# EAGLE design NSL_Tracker-1.2 (EAGLE 5.11)

## Sheet 1 of 7
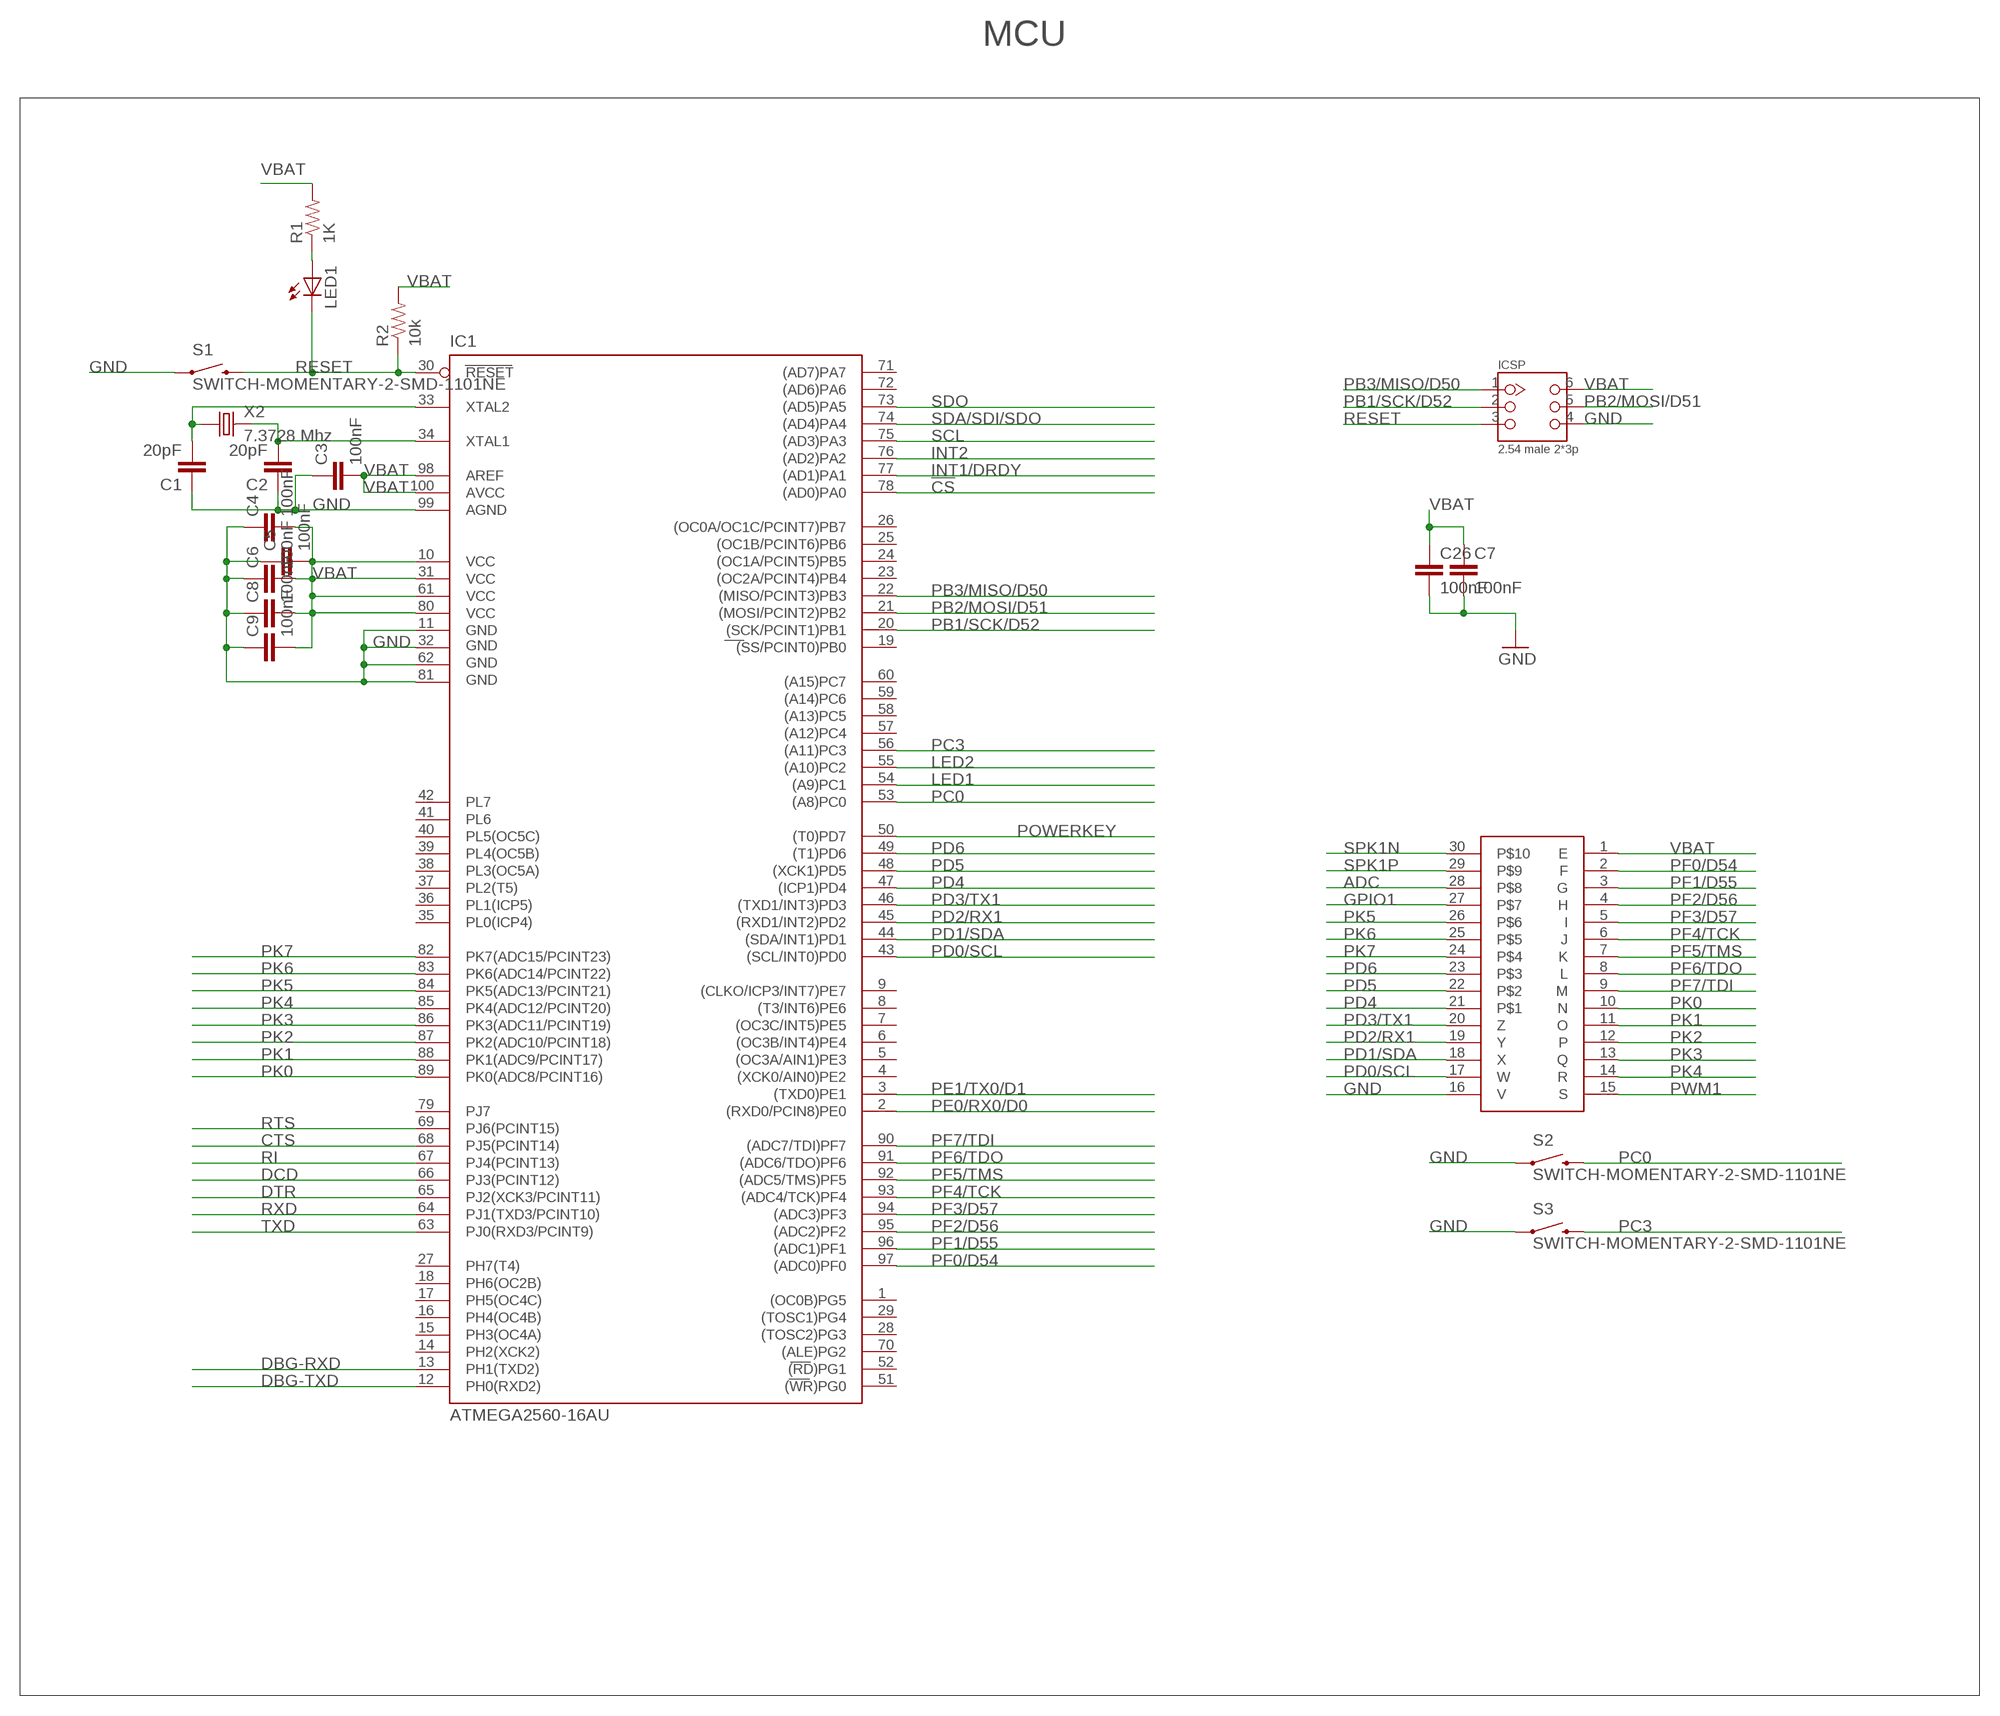
[diagram p0: schematic, sheet 1]

### Parts
C1  20pF  CAP0805  [0805]
C2  20pF  CAP0805  [0805]
C3  100nF  CAP0805  [0805]
C4  100nF  CAP0805  [0805]
C5  100nF  CAP0805  [0805]
C6  100nF  CAP0805  [0805]
C7  100nF  CAP0805  [0805]
C8  100nF  CAP0805  [0805]
C9  100nF  CAP0805  [0805]
C26  100nF  CAP0805  [0805]
IC1  ATMEGA2560-16AU  ATMEGA1280-16AU  [TQFP100]
ICSP  2.54 male 2*3p  HEADER-2X3P2.54  [CK_2X3]
LED1  LEDCHIP-LED0603  [CHIP-LED0603]
R1  1K  RESISTOR0805-RES  [0805]
R2  10k  RESISTOR0805-RES  [0805]
S1  SWITCH-MOMENTARY-2-SMD-1101NE  [TACTILE-SWITCH-1101NE]
S2  SWITCH-MOMENTARY-2-SMD-1101NE  [TACTILE-SWITCH-1101NE]
S3  SWITCH-MOMENTARY-2-SMD-1101NE  [TACTILE-SWITCH-1101NE]
U$1  M30  [M50-2X15]
X2  7.3728 Mhz  CRYSTAL-HC49UP  [HC49UP]

### Nets
!CS: IC1.78((AD0)PA0) ; also sheet 7
ADC: U$1.28 ; also sheet 2
CTS: IC1.68(PJ5(PCINT14)) ; also sheet 2
DBG-RXD: IC1.13(PH1(TXD2)) ; also sheet 2
DBG-TXD: IC1.12(PH0(RXD2)) ; also sheet 2
DCD: IC1.66(PJ3(PCINT12)) ; also sheet 2
DTR: IC1.65(PJ2(XCK3/PCINT11)) ; also sheet 2
GND: C1.1 C2.1 C3.1 C4.1 C5.1 C6.1 C7.2 C8.1 C9.1 C26.2 IC1.11(GND) IC1.32(GND1) IC1.62(GND2) IC1.81(GND3) IC1.99(AGND) ICSP.4 S1.P$1 S2.P$1 S3.P$1 U$1.16(V) ; also sheet 2,3,4,5,6,7
GPIO1: U$1.27 ; also sheet 2
INT1/DRDY: IC1.77((AD1)PA1) ; also sheet 7
INT2: IC1.76((AD2)PA2) ; also sheet 7
LED1: IC1.54((A9)PC1) ; also sheet 4
LED2: IC1.55((A10)PC2) ; also sheet 4
N$2: C2.2 IC1.34(XTAL1) X2.2
N$3: C1.2 IC1.33(XTAL2) X2.1
N$38: LED1.A R1.1
PB1/SCK/D52: IC1.20((SCK/PCINT1)PB1) ICSP.2
PB2/MOSI/D51: IC1.21((MOSI/PCINT2)PB2) ICSP.5
PB3/MISO/D50: IC1.22((MISO/PCINT3)PB3) ICSP.1
PC0: IC1.53((A8)PC0) S2.P$2
PC3: IC1.56((A11)PC3) S3.P$2
PD0/SCL: IC1.43((SCL/INT0)PD0) U$1.17(W)
PD1/SDA: IC1.44((SDA/INT1)PD1) U$1.18(X)
PD2/RX1: IC1.45((RXD1/INT2)PD2) U$1.19(Y)
PD3/TX1: IC1.46((TXD1/INT3)PD3) U$1.20(Z)
PD4: IC1.47((ICP1)PD4) U$1.21
PD5: IC1.48((XCK1)PD5) U$1.22
PD6: IC1.49((T1)PD6) U$1.23
PE0/RX0/D0: IC1.2((RXD0/PCIN8)PE0) ; also sheet 3
PE1/TX0/D1: IC1.3((TXD0)PE1) ; also sheet 3
PF0/D54: IC1.97((ADC0)PF0) U$1.2(F)
PF1/D55: IC1.96((ADC1)PF1) U$1.3(G)
PF2/D56: IC1.95((ADC2)PF2) U$1.4(H)
PF3/D57: IC1.94((ADC3)PF3) U$1.5(I)
PF4/TCK: IC1.93((ADC4/TCK)PF4) U$1.6(J)
PF5/TMS: IC1.92((ADC5/TMS)PF5) U$1.7(K)
PF6/TDO: IC1.91((ADC6/TDO)PF6) U$1.8(L)
PF7/TDI: IC1.90((ADC7/TDI)PF7) U$1.9(M)
PK0: IC1.89(PK0(ADC8/PCINT16)) U$1.10(N)
PK1: IC1.88(PK1(ADC9/PCINT17)) U$1.11(O)
PK2: IC1.87(PK2(ADC10/PCINT18)) U$1.12(P)
PK3: IC1.86(PK3(ADC11/PCINT19)) U$1.13(Q)
PK4: IC1.85(PK4(ADC12/PCINT20)) U$1.14(R)
PK5: IC1.84(PK5(ADC13/PCINT21)) U$1.26
PK6: IC1.83(PK6(ADC14/PCINT22)) U$1.25
PK7: IC1.82(PK7(ADC15/PCINT23)) U$1.24
POWERKEY: IC1.50((T0)PD7) ; also sheet 4
PWM1: U$1.15(S) ; also sheet 2
RESET: IC1.30(RESET) ICSP.3 LED1.C R2.1 S1.P$2
RI: IC1.67(PJ4(PCINT13)) ; also sheet 2
RTS: IC1.69(PJ6(PCINT15)) ; also sheet 2
RXD: IC1.64(PJ1(TXD3/PCINT10)) ; also sheet 2
SCL: IC1.75((AD3)PA3) ; also sheet 7
SDA/SDI/SDO: IC1.74((AD4)PA4) ; also sheet 7
SDO: IC1.73((AD5)PA5) ; also sheet 7
SPK1N: U$1.30 ; also sheet 2
SPK1P: U$1.29 ; also sheet 2
TXD: IC1.63(PJ0(RXD3/PCINT9)) ; also sheet 2
VBAT: C3.2 C4.2 C5.2 C6.2 C7.1 C8.2 C9.2 C26.1 IC1.10(VCC) IC1.31(VCC1) IC1.61(VCC2) IC1.80(VCC3) IC1.98(AREF) IC1.100(AVCC) ICSP.6 R1.2 R2.2 U$1.1(E) ; also sheet 2,3,4,5,7
Unconnected: IC1.1((OC0B)PG5) IC1.4((XCK0/AIN0)PE2) IC1.5((OC3A/AIN1)PE3) IC1.6((OC3B/INT4)PE4) IC1.7((OC3C/INT5)PE5) IC1.8((T3/INT6)PE6) IC1.9((CLKO/ICP3/INT7)PE7) IC1.14(PH2(XCK2)) IC1.15(PH3(OC4A)) IC1.16(PH4(OC4B)) IC1.17(PH5(OC4C)) IC1.18(PH6(OC2B)) IC1.19((SS/PCINT0)PB0) IC1.23((OC2A/PCINT4)PB4) IC1.24((OC1A/PCINT5)PB5) IC1.25((OC1B/PCINT6)PB6) IC1.26((OC0A/OC1C/PCINT7)PB7) IC1.27(PH7(T4)) IC1.28((TOSC2)PG3) IC1.29((TOSC1)PG4) IC1.35(PL0(ICP4)) IC1.36(PL1(ICP5)) IC1.37(PL2(T5)) IC1.38(PL3(OC5A)) IC1.39(PL4(OC5B)) IC1.40(PL5(OC5C)) IC1.41(PL6) IC1.42(PL7) IC1.51((WR)PG0) IC1.52((RD)PG1) IC1.57((A12)PC4) IC1.58((A13)PC5) IC1.59((A14)PC6) IC1.60((A15)PC7) IC1.70((ALE)PG2) IC1.71((AD7)PA7) IC1.72((AD6)PA6) IC1.79(PJ7)

### Notes on the sheet
- MCU

## Sheet 2 of 7
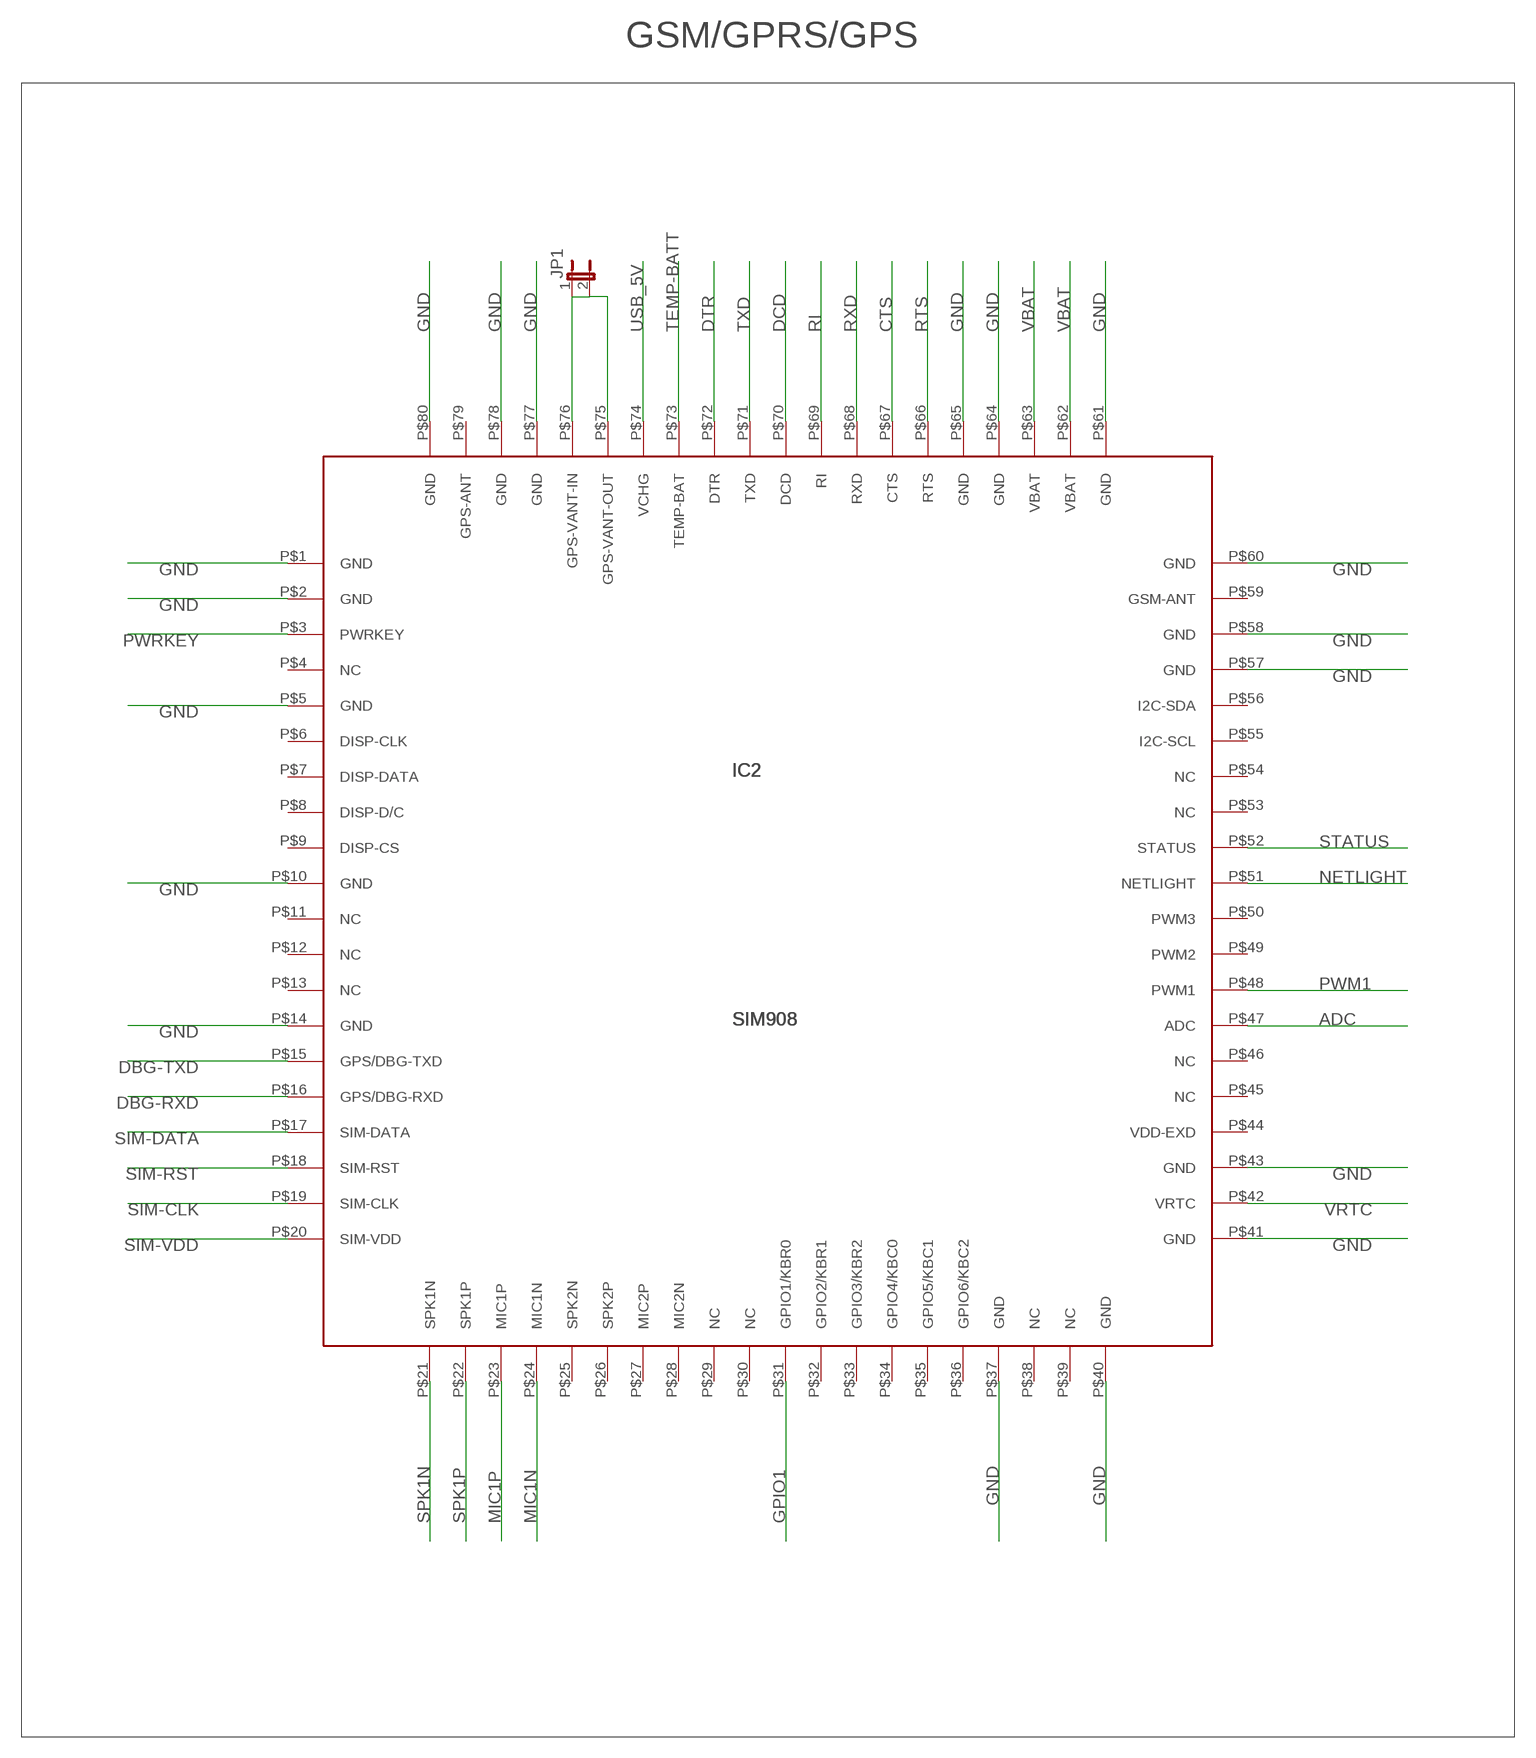
[diagram p1: schematic, sheet 2]

### Parts
IC2  SIM908  [SIM908]
JP1  JUMPER-2SMD-NC  [SJ_2S]

### Nets
ADC: IC2.P$47(ADC) ; also sheet 1
CTS: IC2.P$67(CTS) ; also sheet 1
DBG-RXD: IC2.P$16(GPS/DBG-RXD) ; also sheet 1
DBG-TXD: IC2.P$15(GPS/DBG-TXD) ; also sheet 1
DCD: IC2.P$70(DCD) ; also sheet 1
DTR: IC2.P$72(DTR) ; also sheet 1
GND: IC2.P$1(GND) IC2.P$2(GND) IC2.P$5(GND) IC2.P$10(GND) IC2.P$14(GND) IC2.P$37(GND) IC2.P$40(GND) IC2.P$41(GND) IC2.P$43(GND) IC2.P$57(GND) IC2.P$58(GND) IC2.P$60(GND) IC2.P$61(GND) IC2.P$64(GND) IC2.P$65(GND) IC2.P$77(GND) IC2.P$78(GND) IC2.P$80(GND) ; also sheet 1,3,4,5,6,7
GPIO1: IC2.P$31(GPIO1/KBR0) ; also sheet 1
MIC1N: IC2.P$24(MIC1N) ; also sheet 6
MIC1P: IC2.P$23(MIC1P) ; also sheet 6
N$4: IC2.P$75(GPS-VANT-OUT) IC2.P$76(GPS-VANT-IN) JP1.1 JP1.2
NETLIGHT: IC2.P$51(NETLIGHT) ; also sheet 4
PWM1: IC2.P$48(PWM1) ; also sheet 1
PWRKEY: IC2.P$3(PWRKEY) ; also sheet 4
RI: IC2.P$69(RI) ; also sheet 1
RTS: IC2.P$66(RTS) ; also sheet 1
RXD: IC2.P$68(RXD) ; also sheet 1
SIM-CLK: IC2.P$19(SIM-CLK) ; also sheet 4
SIM-DATA: IC2.P$17(SIM-DATA) ; also sheet 4
SIM-RST: IC2.P$18(SIM-RST) ; also sheet 4
SIM-VDD: IC2.P$20(SIM-VDD) ; also sheet 4
SPK1N: IC2.P$21(SPK1N) ; also sheet 1
SPK1P: IC2.P$22(SPK1P) ; also sheet 1
STATUS: IC2.P$52(STATUS) ; also sheet 4
TEMP-BATT: IC2.P$73(TEMP-BAT) ; also sheet 5
TXD: IC2.P$71(TXD) ; also sheet 1
USB_5V: IC2.P$74(VCHG) ; also sheet 3,5
VBAT: IC2.P$62(VBAT) IC2.P$63(VBAT) ; also sheet 1,3,4,5,7
VRTC: IC2.P$42(VRTC) ; also sheet 5
Unconnected: IC2.P$4(NC) IC2.P$6(DISP-CLK) IC2.P$7(DISP-DATA) IC2.P$8(DISP-D/C) IC2.P$9(DISP-CS) IC2.P$11(NC) IC2.P$12(NC) IC2.P$13(NC) IC2.P$25(SPK2N) IC2.P$26(SPK2P) IC2.P$27(MIC2P) IC2.P$28(MIC2N) IC2.P$29(NC) IC2.P$30(NC) IC2.P$32(GPIO2/KBR1) IC2.P$33(GPIO3/KBR2) IC2.P$34(GPIO4/KBC0) IC2.P$35(GPIO5/KBC1) IC2.P$36(GPIO6/KBC2) IC2.P$38(NC) IC2.P$39(NC) IC2.P$44(VDD-EXD) IC2.P$45(NC) IC2.P$46(NC) IC2.P$49(PWM2) IC2.P$50(PWM3) IC2.P$53(NC) IC2.P$54(NC) IC2.P$55(I2C-SCL) IC2.P$56(I2C-SDA) IC2.P$59(GSM-ANT) IC2.P$79(GPS-ANT)

### Notes on the sheet
- GSM/GPRS/GPS

## Sheet 3 of 7
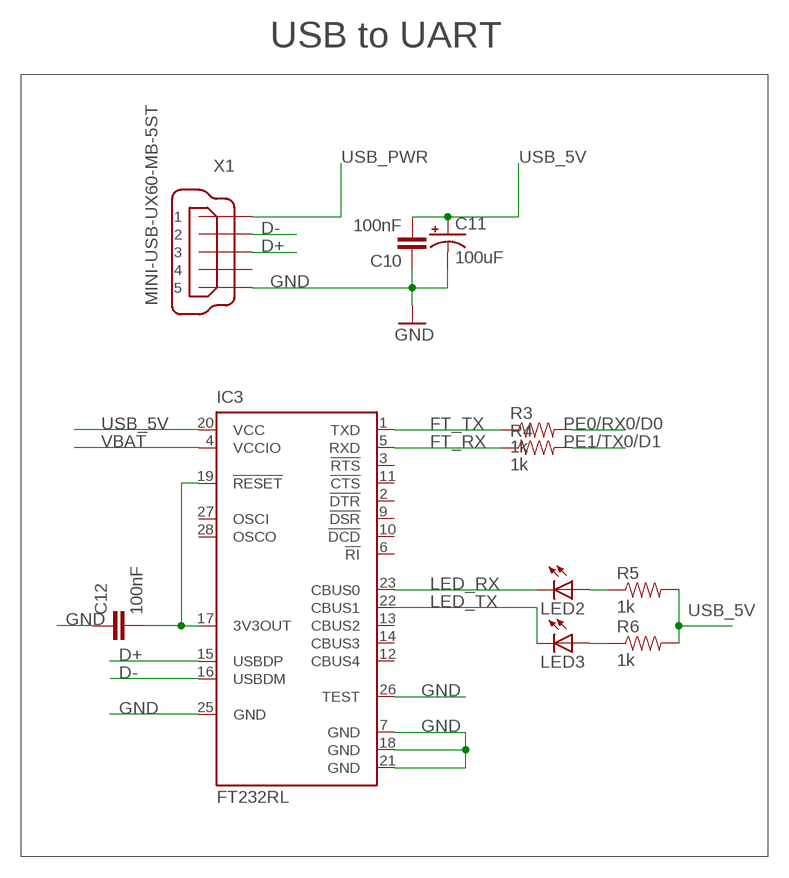
[diagram p2: schematic, sheet 3]

### Parts
C10  100nF  CAP0805  [0805]
C11  100uF  CAP_POL7343  [EIA7343]
C12  100nF  CAP0805  [0805]
IC3  FT232RL  [SSOP28]
LED2  LEDCHIP-LED0603  [CHIP-LED0603]
LED3  LEDCHIP-LED0603  [CHIP-LED0603]
R3  1k  RESISTOR0805-RES  [0805]
R4  1k  RESISTOR0805-RES  [0805]
R5  1k  RESISTOR0805-RES  [0805]
R6  1k  RESISTOR0805-RES  [0805]
X1  MINI-USB-UX60-MB-5ST  [UX60-MB-5ST]

### Nets
D+: IC3.15(USBDP) X1.3
D-: IC3.16(USBDM) X1.2
FT_RX: IC3.5(RXD) R4.1
FT_TX: IC3.1(TXD) R3.1
GND: C10.1 C11.C(-) C12.1 IC3.7(GND) IC3.18(GND) IC3.21(GND) IC3.25(GND) IC3.26(TEST) X1.5 ; also sheet 1,2,4,5,6,7
LED_RX: IC3.23(CBUS0) LED2.C
LED_TX: IC3.22(CBUS1) LED3.C
N$1: C12.2 IC3.17(3V3OUT) IC3.19(!RESET)
N$18: LED2.A R5.1
N$19: LED3.A R6.1
PE0/RX0/D0: R3.2 ; also sheet 1
PE1/TX0/D1: R4.2 ; also sheet 1
USB_5V: C10.2 C11.A(+) IC3.20(VCC) R5.2 R6.2 ; also sheet 2,5
USB_PWR: X1.1 ; also sheet 5
VBAT: IC3.4(VCCIO) ; also sheet 1,2,4,5,7
Unconnected: IC3.2(!DTR) IC3.3(!RTS) IC3.6(!RI) IC3.9(!DSR) IC3.10(!DCD) IC3.11(!CTS) IC3.12(CBUS4) IC3.13(CBUS2) IC3.14(CBUS3) IC3.27(OSCI) IC3.28(OSCO) X1.4

### Notes on the sheet
- USB to UART

## Sheet 4 of 7
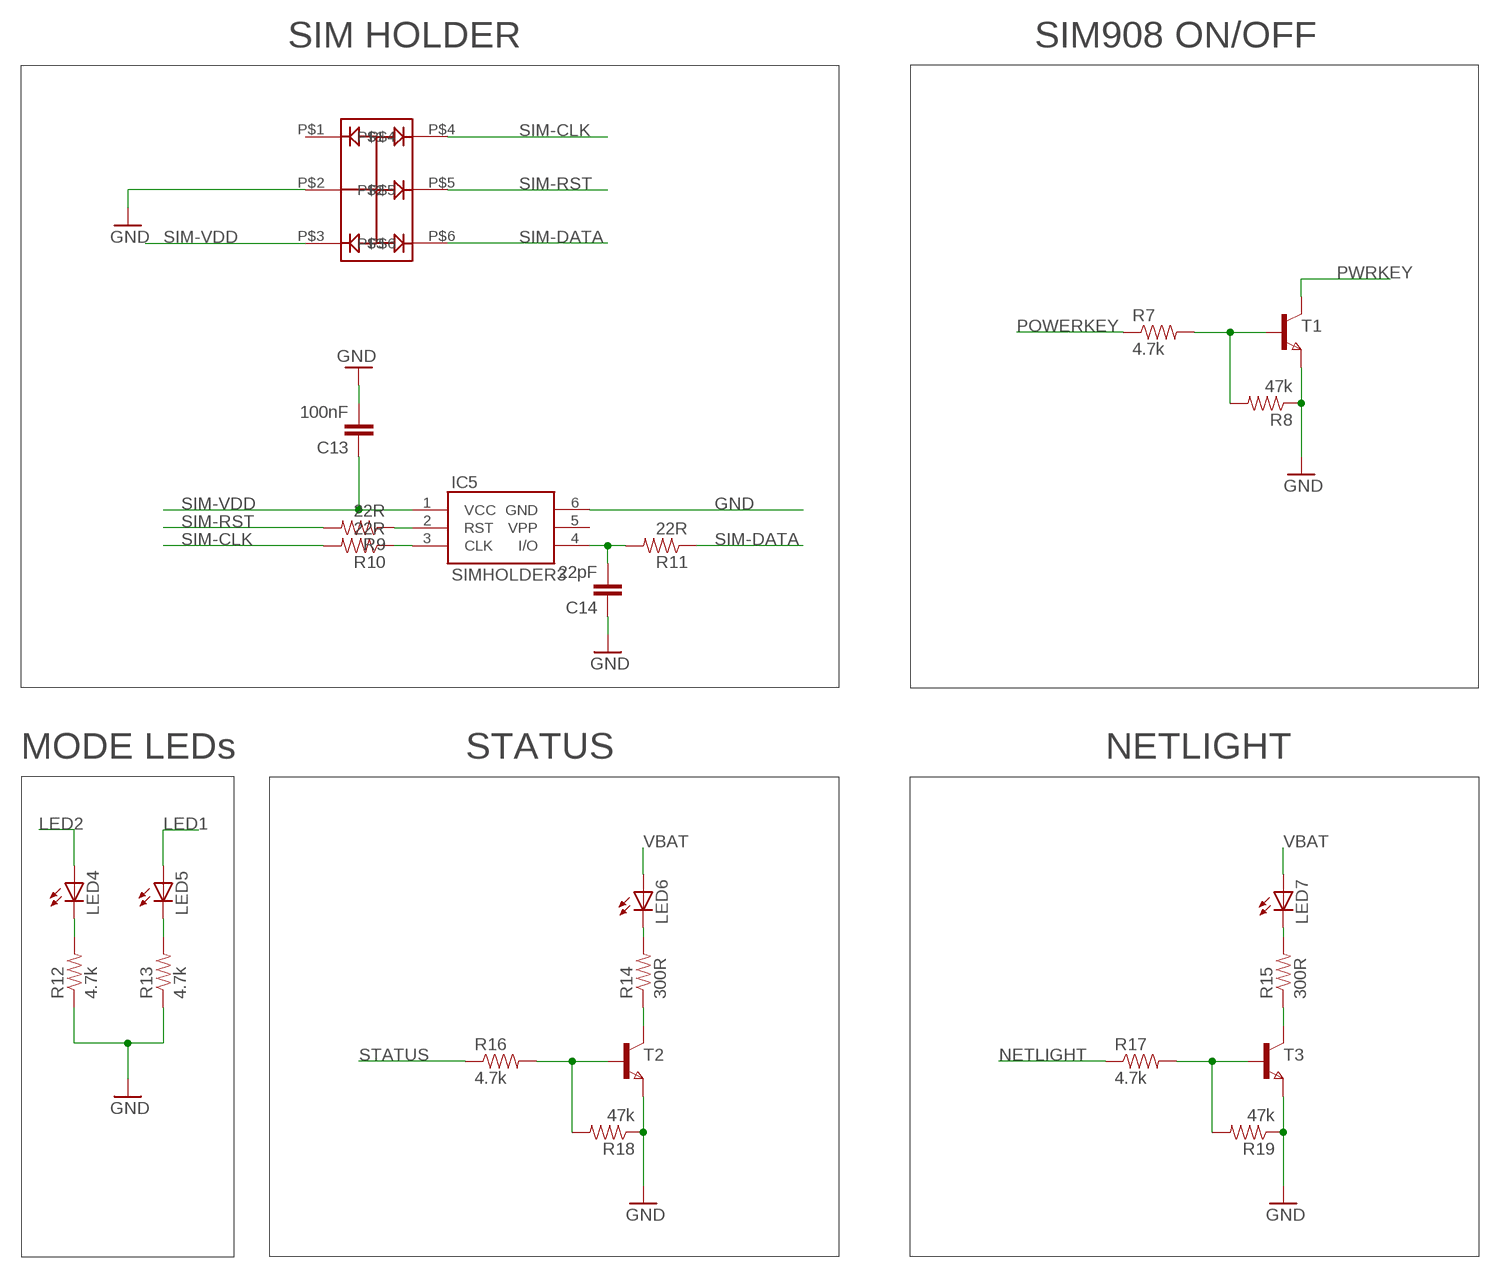
[diagram p3: schematic, sheet 4]

### Parts
C13  100nF  CAP0805  [0805]
C14  22pF  CAP0805  [0805]
IC4  SMF05C  [SC-88]
IC5  SIMHOLDER3  [SIMHOLDER3]
LED4  LEDCHIP-LED0603  [CHIP-LED0603]
LED5  LEDCHIP-LED0603  [CHIP-LED0603]
LED6  LEDCHIP-LED0603  [CHIP-LED0603]
LED7  LEDCHIP-LED0603  [CHIP-LED0603]
R7  4.7k  RESISTOR0805-RES  [0805]
R8  47k  RESISTOR0805-RES  [0805]
R9  22R  RESISTOR0805-RES  [0805]
R10  22R  RESISTOR0805-RES  [0805]
R11  22R  RESISTOR0805-RES  [0805]
R12  4.7k  RESISTOR0805-RES  [0805]
R13  4.7k  RESISTOR0805-RES  [0805]
R14  300R  RESISTOR0805-RES  [0805]
R15  300R  RESISTOR0805-RES  [0805]
R16  4.7k  RESISTOR0805-RES  [0805]
R17  4.7k  RESISTOR0805-RES  [0805]
R18  47k  RESISTOR0805-RES  [0805]
R19  47k  RESISTOR0805-RES  [0805]
T1  NPNSOT23  [SOT-23]
T2  NPNSOT23  [SOT-23]
T3  NPNSOT23  [SOT-23]

### Nets
GND: C13.2 C14.1 IC4.P$2 IC5.6(GND) R8.1 R12.1 R13.1 R18.1 R19.1 T1.2(E) T2.2(E) T3.2(E) ; also sheet 1,2,3,5,6,7
LED1: LED5.A ; also sheet 1
LED2: LED4.A ; also sheet 1
N$6: R17.2 R19.2 T3.3(B)
N$7: R7.2 R8.2 T1.3(B)
N$8: IC5.2(RST) R9.1
N$9: IC5.3(CLK) R10.1
N$10: C14.2 IC5.4(I/O) R11.2
N$11: LED7.C R15.2
N$12: R15.1 T3.1(C)
N$13: R16.2 R18.2 T2.3(B)
N$14: LED6.C R14.2
N$15: R14.1 T2.1(C)
N$20: LED5.C R13.2
N$21: LED4.C R12.2
NETLIGHT: R17.1 ; also sheet 2
POWERKEY: R7.1 ; also sheet 1
PWRKEY: T1.1(C) ; also sheet 2
SIM-CLK: IC4.P$4 R10.2 ; also sheet 2
SIM-DATA: IC4.P$6 R11.1 ; also sheet 2
SIM-RST: IC4.P$5 R9.2 ; also sheet 2
SIM-VDD: C13.1 IC4.P$3 IC5.1(VCC) ; also sheet 2
STATUS: R16.1 ; also sheet 2
VBAT: LED6.A LED7.A ; also sheet 1,2,3,5,7
Unconnected: IC4.P$1 IC5.5(VPP)

### Notes on the sheet
- SIM HOLDER | SIM908 ON/OFF
- MODE LEDs | STATUS | NETLIGHT

## Sheet 5 of 7
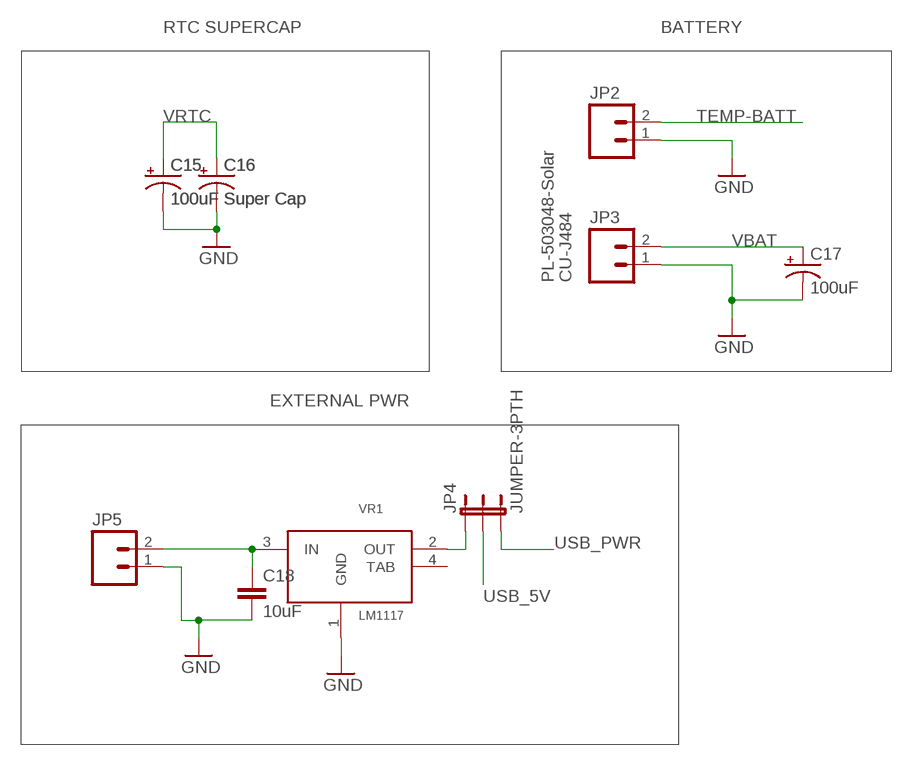
[diagram p4: schematic, sheet 5]

### Parts
C15  100uF  CAP_POL7343  [EIA7343]
C16  Super Cap  CAP_POL322510  [322510_SUPERCAP]
C17  100uF  CAP_POL7343  [EIA7343]
C18  10uF  CAP0805  [0805]
JP2  M02PTH  [1X02]
JP3  M02POLAR  [MOLEX-1X2]
JP4  JUMPER-3PTH  [1X03]
JP5  M02POLAR  [MOLEX-1X2]
VR1  LM1117  [SOT-223]

### Nets
GND: C15.C(-) C16.2(-) C17.C(-) C18.2 JP2.1 JP3.1 JP5.1 VR1.1(GND) ; also sheet 1,2,3,4,6,7
N$16: C18.1 JP5.2 VR1.3(IN)
N$17: JP4.1 VR1.2(OUT)
TEMP-BATT: JP2.2 ; also sheet 2
USB_5V: JP4.2 ; also sheet 2,3
USB_PWR: JP4.3 ; also sheet 3
VBAT: C17.A(+) JP3.2 ; also sheet 1,2,3,4,7
VRTC: C15.A(+) C16.1(+) ; also sheet 2
Unconnected: VR1.4(TAB)

### Notes on the sheet
- RTC SUPERCAP | BATTERY
- PL-503048-Solar | CU-J484
- EXTERNAL PWR

## Sheet 6 of 7
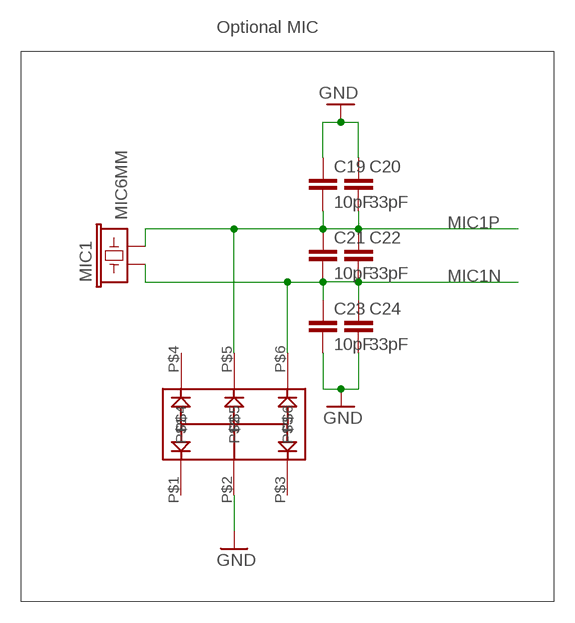
[diagram p5: schematic, sheet 6]

### Parts
C19  10pF  CAP0805  [0805]
C20  33pF  CAP0805  [0805]
C21  10pF  CAP0805  [0805]
C22  33pF  CAP0805  [0805]
C23  10pF  CAP0805  [0805]
C24  33pF  CAP0805  [0805]
IC6  SMF05C  [SC-88]
MIC1  MIC6MM  [MIC-6MM]

### Nets
GND: C19.1 C20.1 C23.2 C24.2 IC6.P$2 ; also sheet 1,2,3,4,5,7
MIC1N: C21.2 C22.2 C23.1 C24.1 IC6.P$6 MIC1.1 ; also sheet 2
MIC1P: C19.2 C20.2 C21.1 C22.1 IC6.P$5 MIC1.2 ; also sheet 2
Unconnected: IC6.P$1 IC6.P$3 IC6.P$4

### Notes on the sheet
- Optional MIC

## Sheet 7 of 7
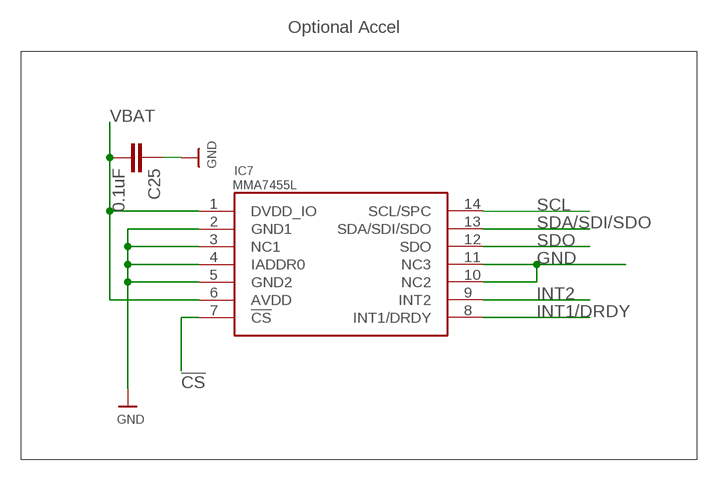
[diagram p6: schematic, sheet 7]

### Parts
C25  0.1uF  CAP0805  [0805]
IC7  MMA7455L  [LGA-14]

### Nets
!CS: IC7.7(!CS) ; also sheet 1
GND: C25.1 IC7.2(GND1) IC7.3(NC1) IC7.4(IADDR0) IC7.5(GND2) IC7.10(NC2) IC7.11(NC3) ; also sheet 1,2,3,4,5,6
INT1/DRDY: IC7.8(INT1/DRDY) ; also sheet 1
INT2: IC7.9(INT2) ; also sheet 1
SCL: IC7.14(SCL/SPC) ; also sheet 1
SDA/SDI/SDO: IC7.13(SDA/SDI/SDO) ; also sheet 1
SDO: IC7.12(SDO) ; also sheet 1
VBAT: C25.2 IC7.1(DVDD_IO) IC7.6(AVDD) ; also sheet 1,2,3,4,5

### Notes on the sheet
- Optional Accel

## Library data of the parts
C1-C10 C12-C14 C18-C26 = SparkFun:CAP: Capacitor Standard 0603 ceramic capacitor, and 0.1" leaded capacitor.
C11 C17 = SparkFun:CAP_POL: Capacitor Polarized These are standard SMD and PTH capacitors. Normally 10uF, 47uF, and 100uF in electrolytic and tantalum varieties. Always verify the external diameter of the through hole cap, it varies with capacity, voltage, and manufacturer. The EIA devices should be standard.
C15 C16 = NSL_Tracker:CAP_POL: Capacitor Polarized These are standard SMD and PTH capacitors. Normally 10uF, 47uF, and 100uF in electrolytic and tantalum varieties. Always verify the external diameter of the through hole cap, it varies with capacity, voltage, and manufacturer. The EIA devices should be standard.
IC1 = ICs_v54:ATMEGA*: MICROCONTROLLER 64/128/256 Kbytes FLASH 4 Kbytes EEPROM 8 Kbytes SRAM 86 General Purpose I/O pins 12-channels16-bit PWM 4 x Serial USARTs 16-channels 10-bit A/D
IC2 = NSL_Tracker:SIM908
IC3 = ICs_v54:FT232R: Source: http://www.ftdichip.com/Documents/DataSheets/DS_FT232R_v104.pdf
IC4 IC6 = NSL_Tracker:SMF05C
IC5 = SparkFun:SIMHOLDER3
IC7 = MMA7455Lbreakoutboard-v1a:MMA7455L
ICSP = Connector:HEADER-2X3P
JP1 = SparkFun:JUMPER-2: Jumper Basic 0.1" spaced jumper. Use with breakaway headers.
JP2 = SparkFun:M02: Header 2 Standard 2-pin 0.1" header. Use with straight break away headers (SKU : PRT-00116), right angle break away headers (PRT-00553), swiss pins (PRT-00743), machine pins (PRT-00117), and female headers (PRT-00115). Molex polarized connector foot print use with SKU : PRT-08233 with associated crimp pins and housings.
JP3 JP5 = PWM_ATUC64L4U:M02: Header 2 Standard 2-pin 0.1" header. Use with straight break away headers (SKU : PRT-00116), right angle break away headers (PRT-00553), swiss pins (PRT-00743), machine pins (PRT-00117), and female headers (PRT-00115). Molex polarized connector foot print use with SKU : PRT-08233 with associated crimp pins and housings.
JP4 = SparkFun:JUMPER-3
LED1-LED7 = led:LED: LED OSRAM: - CHIPLED LG R971, LG N971, LY N971, LG Q971, LY Q971, LO R971, LY R971 LH N974, LH R974 LS Q976, LO Q976, LY Q976 LO Q996 - Hyper CHIPLED LW Q18S LB Q993, LB Q99A, LB R99A - SideLED LS A670, LO A670, LY A670, LG A670, LP A670 LB A673, LV A673, LT A673, LW A673 LH A674 LY A675 LS A676, LA A676, LO A676, LY A676, LW A676 LS A679, LY A679, LG A679 - Hyper Micro SIDELED® LS Y876, LA Y876, LO Y876, LY Y876 LT Y87S - SmartLED LW L88C, LW L88S LB L89C, LB L89S, LG L890 LS L89K, LO L89K, LY L89K LS L896, LA L896, LO L896, LY L896 - TOPLED LS T670, LO T670, LY T670, LG T670, LP T670 LSG T670, LSP T670, LSY T670, LOP T670, LYG T670 LG T671, LOG T671, LSG T671 LB T673, LV T673, LT T673, LW T673 LH T674 LS T676, LA T676, LO T676, LY T676, LB T676, LH T676, LSB T676, LW T676 LB T67C, LV T67C, LT T67C, LS T67K, LO T67K, LY T67K, LW E67C LS E67B, LA E67B, LO E67B, LY E67B, LB E67C, LV E67C, LT E67C LW T67C LS T679, LY T679, LG T679 LS T770, LO T770, LY T770, LG T770, LP T770 LB T773, LV T773, LT T773, LW T773 LH T774 LS E675, LA E675, LY E675, LS T675 LS T776, LA T776, LO T776, LY T776, LB T776 LHGB T686 LT T68C, LB T68C - Hyper Mini TOPLED® LB M676 - Mini TOPLED Santana® LG M470 LS M47K, LO M47K, LY M47K Source: http://www.osram.convergy.de LUXEON: - LUMILED® LXK2-PW12-R00, LXK2-PW12-S00, LXK2-PW14-U00, LXK2-PW14-V00 LXK2-PM12-R00, LXK2-PM12-S00, LXK2-PM14-U00 LXK2-PE12-Q00, LXK2-PE12-R00, LXK2-PE12-S00, LXK2-PE14-T00, LXK2-PE14-U00 LXK2-PB12-K00, LXK2-PB12-L00, LXK2-PB12-M00, LXK2-PB14-N00, LXK2-PB14-P00, LXK2-PB14-Q00 LXK2-PR12-L00, LXK2-PR12-M00, LXK2-PR14-Q00, LXK2-PR14-R00 LXK2-PD12-Q00, LXK2-PD12-R00, LXK2-PD12-S00 LXK2-PH12-R00, LXK2-PH12-S00 LXK2-PL12-P00, LXK2-PL12-Q00, LXK2-PL12-R00 Source: www.luxeon.com KINGBRIGHT: KA-3528ASYC Source: www.kingbright.com
MIC1 = slice_noshift:MIC: Microphone Omni-directional electret microphone. 9.7mm standard diameter.
R1-R19 = SparkFun:RESISTOR: Resistor Basic schematic elements and footprints for 0603, 1206, and PTH resistors.
S1-S3 = NSL_Tracker:SWITCH-MOMENTARY-2
T1-T3 = zetex:NPNSOT23: NPN TRANSISTOR; MPN: DSS20201L-7; OC_FARNELL: 1710688; OC_NEWARK: 25R4555
U$1 = NSL_Tracker:M30
VR1 = pcbqr_v4:LM1117
X1 = ATCUxxxl3U_Synth_4layer:MINI-USB-: MINI USB Connector Source: http://www.hirose.co.jp/cataloge_hp/e24000019.pdf; OC_FARNELL: unknown; OC_NEWARK: unknown
X2 = NSL_Tracker:CRYSTAL*: CRYSTAL

## Board
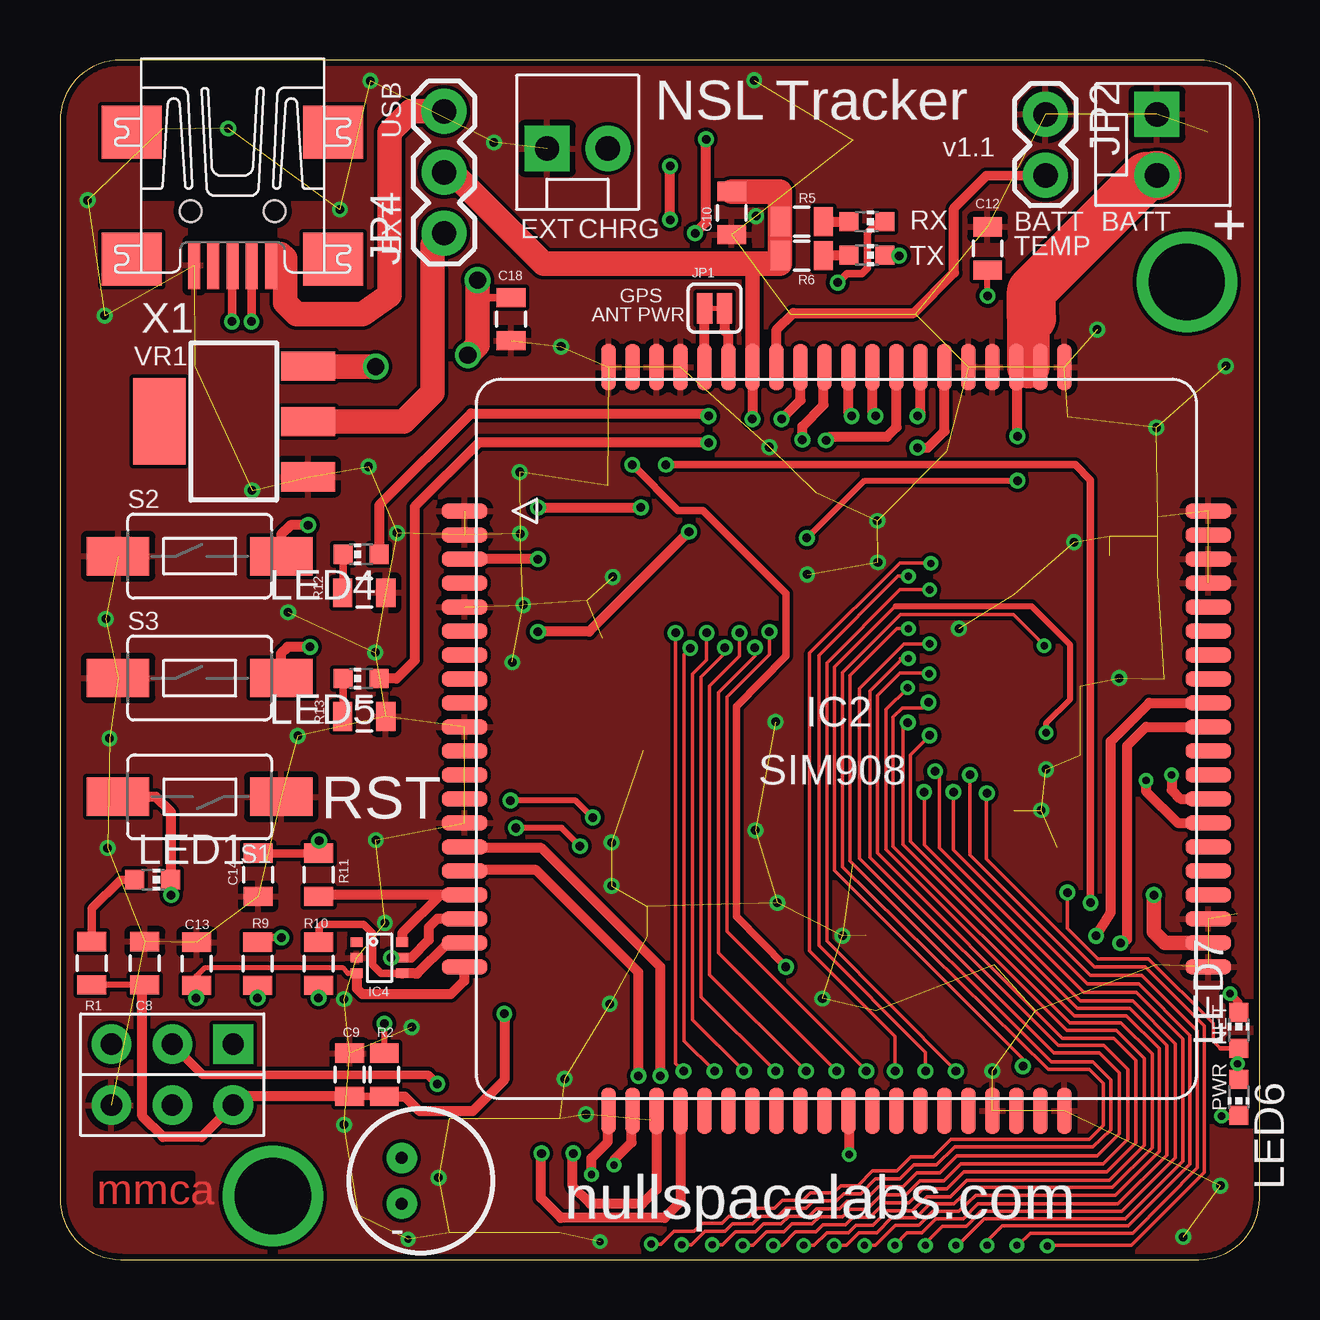
[diagram p7: board, top side]
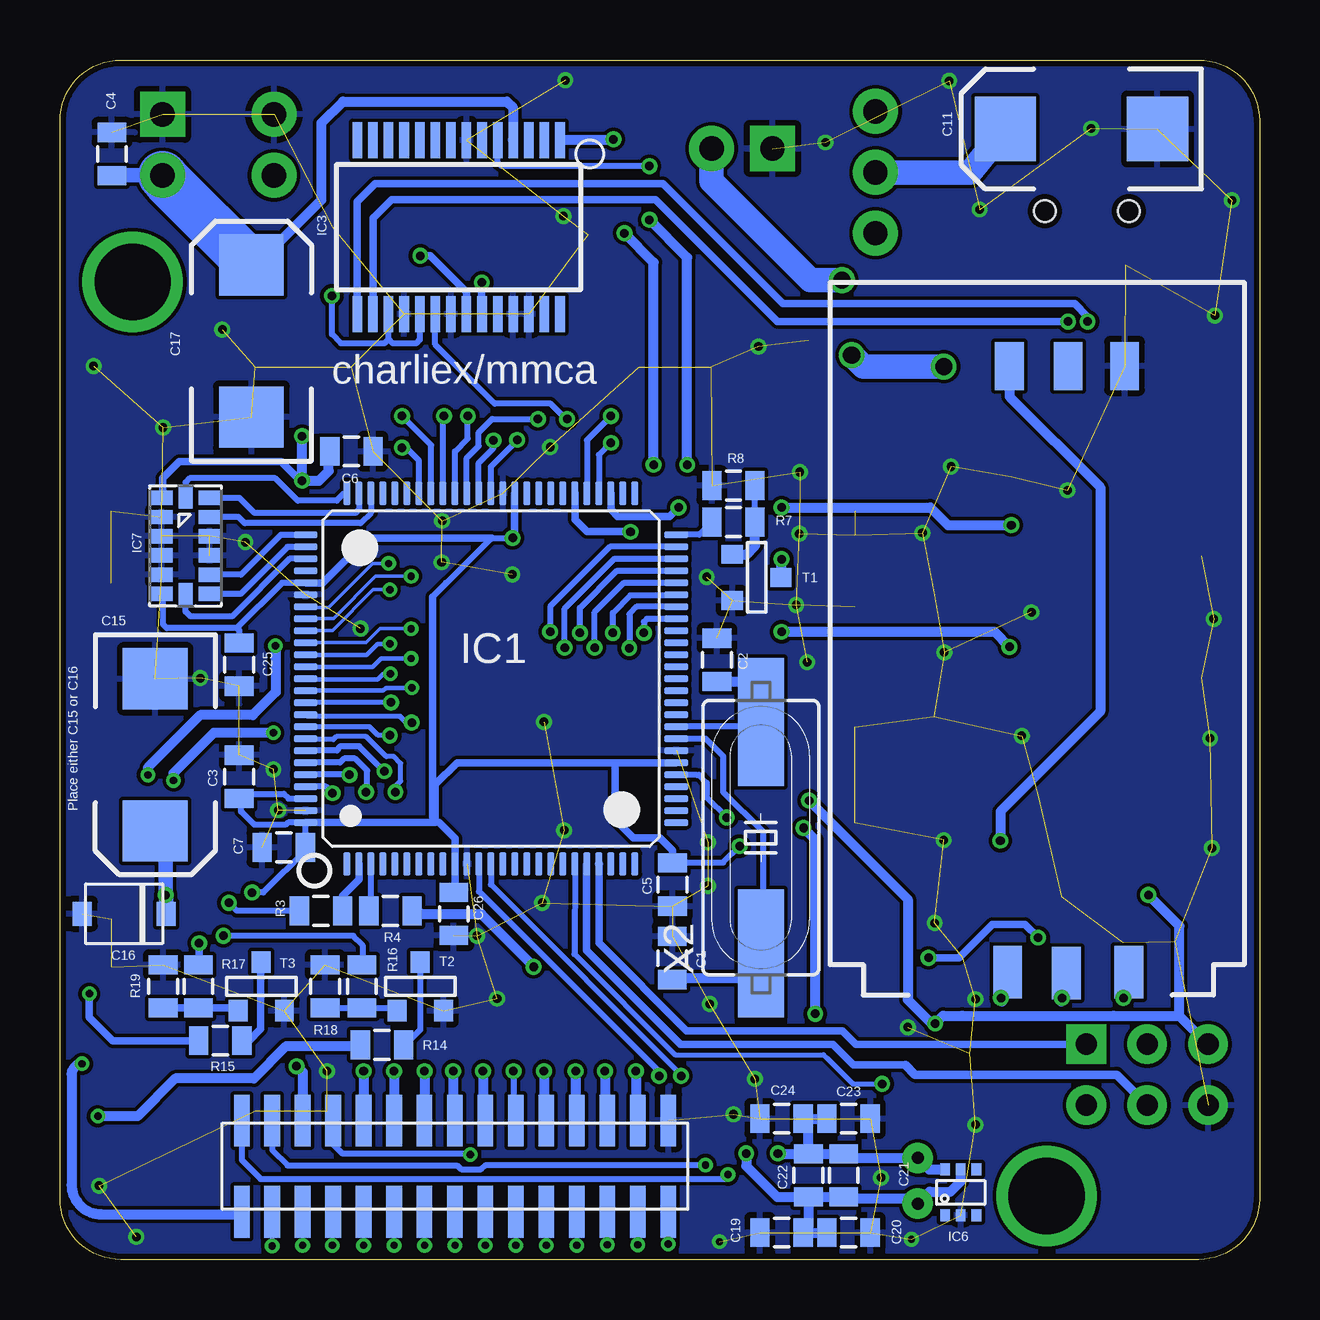
[diagram p8: board, bottom side, seen from below]

Size 50 x 50 mm. Coordinates in mm from the lower left corner, seen from the top.
Outline: 47.46,0 arc90 50,2.54 50,47.46 arc90 47.46,50 2.54,50 arc90 0,47.46 0,2.54 arc90 2.54,0 47.46,0
Copper layers (1*16): Top 0.035mm / dielectric 1.5mm / Bottom 0.035mm
Design rules "ITead_rule *": minimum track width 6mil, minimum drill 12mil, track to track 6mil, track to pad 6mil, pad to pad 6mil, via to via 6mil, smd to smd 0mil, copper to edge 10mil, drill to drill 10mil, minimum pad ring 10mil, minimum via ring 6mil, stop-mask expansion 2mil, vias tented up to drill 19mil, thermal gap 10mil

### Footprints (pad centres in the part's own frame; a part is rotated, then mirrored left to right if it is on the bottom)
0805 = smd 0.8 x 1.2: 1 -0.9,0; 2 0.9,0
EIA7343 = smd 2.55 x 2.7: A 3.17,0; C -3.17,0
322510_SUPERCAP = smd 0.8 x 1: 1 -1.75,0; 2 1.75,0
TQFP100 = smd 1 x 0.3: 1 -7.725,6; 2 -7.725,5.5; 3 -7.725,5; 4 -7.725,4.5; 5 -7.725,4; 6 -7.725,3.5; 7 -7.725,3; 8 -7.725,2.5; 9 -7.725,2; 10 -7.725,1.5; 11 -7.725,1; 12 -7.725,0.5; 13 -7.725,0; 14 -7.725,-0.5; 15 -7.725,-1; 16 -7.725,-1.5; 17 -7.725,-2; 18 -7.725,-2.5; 19 -7.725,-3; 20 -7.725,-3.5; 21 -7.725,-4; 22 -7.725,-4.5; 23 -7.725,-5; 24 -7.725,-5.5; 25 -7.725,-6; 51 7.725,-6; 52 7.725,-5.5; 53 7.725,-5; 54 7.725,-4.5; 55 7.725,-4; 56 7.725,-3.5; 57 7.725,-3; 58 7.725,-2.5; 59 7.725,-2; 60 7.725,-1.5; 61 7.725,-1; 62 7.725,-0.5; 63 7.725,0; 64 7.725,0.5; 65 7.725,1; 66 7.725,1.5; 67 7.725,2; 68 7.725,2.5; 69 7.725,3; 70 7.725,3.5; 71 7.725,4; 72 7.725,4.5; 73 7.725,5; 74 7.725,5.5; 75 7.725,6 | smd 0.3 x 1: 26 -6,-7.725; 27 -5.5,-7.725; 28 -5,-7.725; 29 -4.5,-7.725; 30 -4,-7.725; 31 -3.5,-7.725; 32 -3,-7.725; 33 -2.5,-7.725; 34 -2,-7.725; 35 -1.5,-7.725; 36 -1,-7.725; 37 -0.5,-7.725; 38 0,-7.725; 39 0.5,-7.725; 40 1,-7.725; 41 1.5,-7.725; 42 2,-7.725; 43 2.5,-7.725; 44 3,-7.725; 45 3.5,-7.725; 46 4,-7.725; 47 4.5,-7.725; 48 5,-7.725; 49 5.5,-7.725; 50 6,-7.725; 76 6,7.725; 77 5.5,7.725; 78 5,7.725; 79 4.5,7.725; 80 4,7.725; 81 3.5,7.725; 82 3,7.725; 83 2.5,7.725; 84 2,7.725; 85 1.5,7.725; 86 1,7.725; 87 0.5,7.725; 88 0,7.725; 89 -0.5,7.725; 90 -1,7.725; 91 -1.5,7.725; 92 -2,7.725; 93 -2.5,7.725; 94 -3,7.725; 95 -3.5,7.725; 96 -4,7.725; 97 -4.5,7.725; 98 -5,7.725; 99 -5.5,7.725; 100 -6,7.725
SIM908 = smd 1.9 x 0.6: P$1 -15.5,9.5; P$2 -15.5,8.5; P$3 -15.5,7.5; P$4 -15.5,6.5; P$5 -15.5,5.5; P$6 -15.5,4.5; P$7 -15.5,3.5; P$8 -15.5,2.5; P$9 -15.5,1.5; P$10 -15.5,0.5; P$11 -15.5,-0.5; P$12 -15.5,-1.5; P$13 -15.5,-2.5; P$14 -15.5,-3.5; P$15 -15.5,-4.5; P$16 -15.5,-5.5; P$17 -15.5,-6.5; P$18 -15.5,-7.5; P$19 -15.5,-8.5; P$20 -15.5,-9.5; P$41 15.5,-9.5; P$42 15.5,-8.5; P$43 15.5,-7.5; P$44 15.5,-6.5; P$45 15.5,-5.5; P$46 15.5,-4.5; P$47 15.5,-3.5; P$48 15.5,-2.5; P$49 15.5,-1.5; P$50 15.5,-0.5; P$51 15.5,0.5; P$52 15.5,1.5; P$53 15.5,2.5; P$54 15.5,3.5; P$55 15.5,4.5; P$56 15.5,5.5; P$57 15.5,6.5; P$58 15.5,7.5; P$59 15.5,8.5; P$60 15.5,9.5 | smd 0.6 x 1.9: P$21 -9.5,-15.5; P$22 -8.5,-15.5; P$23 -7.5,-15.5; P$24 -6.5,-15.5; P$25 -5.5,-15.5; P$26 -4.5,-15.5; P$27 -3.5,-15.5; P$28 -2.5,-15.5; P$29 -1.5,-15.5; P$30 -0.5,-15.5; P$31 0.5,-15.5; P$32 1.5,-15.5; P$33 2.5,-15.5; P$34 3.5,-15.5; P$35 4.5,-15.5; P$36 5.5,-15.5; P$37 6.5,-15.5; P$38 7.5,-15.5; P$39 8.5,-15.5; P$40 9.5,-15.5; P$61 9.5,15.5; P$62 8.5,15.5; P$63 7.5,15.5; P$64 6.5,15.5; P$65 5.5,15.5; P$66 4.5,15.5; P$67 3.5,15.5; P$68 2.5,15.5; P$69 1.5,15.5; P$70 0.5,15.5; P$71 -0.5,15.5; P$72 -1.5,15.5; P$73 -2.5,15.5; P$74 -3.5,15.5; P$75 -4.5,15.5; P$76 -5.5,15.5; P$77 -6.5,15.5; P$78 -7.5,15.5; P$79 -8.5,15.5; P$80 -9.5,15.5
SSOP28 = smd 0.4 x 1.5: 1 -4.225,-3.625; 2 -3.575,-3.625; 3 -2.925,-3.625; 4 -2.275,-3.625; 5 -1.625,-3.625; 6 -0.975,-3.625; 7 -0.325,-3.625; 8 0.325,-3.625; 9 0.975,-3.625; 10 1.625,-3.625; 11 2.275,-3.625; 12 2.925,-3.625; 13 3.575,-3.625; 14 4.225,-3.625; 15 4.225,3.625; 16 3.575,3.625; 17 2.925,3.625; 18 2.275,3.625; 19 1.625,3.625; 20 0.975,3.625; 21 0.325,3.625; 22 -0.325,3.625; 23 -0.975,3.625; 24 -1.625,3.625; 25 -2.275,3.625; 26 -2.925,3.625; 27 -3.575,3.625; 28 -4.225,3.625
SC-88 = smd 0.4 x 0.5: P$1 -0.65,-0.95; P$2 0,-0.95; P$3 0.65,-0.95; P$4 0.65,0.95; P$5 0,0.95; P$6 -0.65,0.95
SIMHOLDER3 = smd 2.2 x 1.2: 1 0.95,4.81; 2 0.91,7.41; 3 0.95,9.86 | smd 2 x 1.2: 4 26.2,9.78; 5 26.22,7.34; 6 26.22,4.98
LGA-14 = smd 0.6 x 0.9: 1 -2,-1; 2 -1.2,-1; 3 -0.4,-1; 4 0.4,-1; 5 1.2,-1; 6 2,-1; 8 2,1; 9 1.2,1; 10 0.4,1; 11 -0.4,1; 12 -1.2,1; 13 -2,1 | smd 0.9 x 0.6: 7 2,0; 14 -2,0
CK_2X3 = drill 0.889 pad 1.651 square: 1 -1.27,2.54 | drill 0.889 pad 1.651 round: 2 -1.27,0; 3 -1.27,-2.54; 4 1.27,-2.54; 5 1.27,0; 6 1.27,2.54
SJ_2S = smd 0.635 x 1.27: 1 -0.412,0; 2 0.412,0
1X02 = drill 1.016 pad 1.88 round: 1 0,0; 2 2.54,0
MOLEX-1X2 = drill 1.016 pad 1.88 square: 1 0,0 | drill 1.016 pad 1.88 round: 2 2.54,0
1X03 = drill 1.016 pad 1.88 round: 1 0,0; 2 2.54,0; 3 5.08,0
CHIP-LED0603 = smd 0.8 x 0.8: A 0,-0.75; C 0,0.75
MIC-6MM = drill 0.5 pad 1.27 round: 1 -0.8,0.95; 2 -0.8,-0.95
TACTILE-SWITCH-1101NE = smd 2.6 x 1.6: P$1 -3.4,0; P$2 3.4,0
SOT-23 = smd 0.787 x 0.889: 1 0.025,-1.016; 2 -0.94,1.016; 3 0.991,1.016
M50-2X15 = smd 0.65 x 2.15: 1 -8.89,-1.905; 2 -7.62,-1.905; 3 -6.35,-1.905; 4 -5.08,-1.905; 5 -3.81,-1.905; 6 -2.54,-1.905; 7 -1.27,-1.905; 8 0,-1.905; 9 1.27,-1.905; 10 2.54,-1.905; 11 3.81,-1.905; 12 5.08,-1.905; 13 6.35,-1.905; 14 7.62,-1.905; 15 8.89,-1.905; 16 8.89,1.905; 17 7.62,1.905; 18 6.35,1.905; 19 5.08,1.905; 20 3.81,1.905; 21 2.54,1.905; 22 1.27,1.905; 23 0,1.905; 24 -1.27,1.905; 25 -2.54,1.905; 26 -3.81,1.905; 27 -5.08,1.905; 28 -6.35,1.905; 29 -7.62,1.905; 30 -8.89,1.905
SOT-223 = smd 1.219 x 2.235: 1 -2.311,-3.099; 2 0,-3.099; 3 2.311,-3.099 | smd 3.6 x 2.2: 4 0,3.099
UX60-MB-5ST = smd 2 x 0.5: 1 2.25,1.6; 2 2.25,0.8; 3 2.25,0; 4 2.25,-0.8; 5 2.25,-1.6 | smd 2.2 x 2.5: M1 -3.3,-4.2; M2 -3.3,4.2; M3 2,4.2; M4 2,-4.2 | hole 0.9: 0,-1.75; 0,1.75
HC49UP = smd 5.334 x 1.93: 1 -4.826,0; 2 4.826,0

### Placement (x,y rotation side)
C1  24.48,12.57 270 bottom
C2  22.61,25 270 bottom
C3  42.53,20.12 270 bottom
C4  47.83,46.08 270 bottom
C5  24.47,15.63 90 bottom
C6  37.85,33.69 180 bottom
C7  40.67,17.18 180 bottom
C8  3.54,12.35 270 top
C9  12.07,7.7 270 top
C10  28,43.62 90 top
C11  7.42,47.12 180 bottom
C12  38.67,42.14 270 top
C13  5.7,12.33 90 top
C14  8.26,16.03 90 top
C15  46.03,21.04 270 bottom
C16  47.33,14.41 180 bottom
C17  42.02,38.28 90 bottom
C18  18.8,39.2 270 top
C19  19.92,1.12 0 bottom
C20  17.13,1.12 180 bottom
C21  17.33,3.51 90 bottom
C22  18.8,3.51 90 bottom
C23  17.13,5.87 0 bottom
C24  19.92,5.87 180 bottom
C25  42.53,24.8 90 bottom
C26  33.59,14.41 270 bottom
IC1  32.04,24.21 90 bottom
IC2  32.37,21.7 0 top
IC3  33.38,43.03 180 bottom
IC4  13.32,12.58 270 top
IC5  0.64,11.03 90 bottom
IC6  12.45,2.8 0 bottom
IC7  44.76,29.75 270 bottom
ICSP  4.68,7.7 270 top
JP1  27.29,39.66 0 top
JP2  41.08,47.73 270 top
JP3  45.73,47.73 270 top
JP4  16.01,42.78 90 top
JP5  20.3,46.31 0 top
LED1  3.87,15.83 270 top
LED2  33.64,43.26 270 top
LED3  33.64,41.87 270 top
LED4  12.55,29.39 90 top
LED5  12.55,24.21 90 top
LED6  49.13,6.76 180 top
LED7  49.13,9.56 0 top
MIC1  15.04,3.28 0 top
R1  1.33,12.35 270 top
R2  13.52,7.7 270 top
R3  39.12,14.54 0 bottom
R4  36.23,14.54 180 bottom
R5  30.92,43.26 180 top
R6  30.92,41.84 180 top
R7  21.93,30.74 0 bottom
R8  21.93,32.26 0 bottom
R9  8.24,12.33 90 top
R10  10.78,12.33 90 top
R11  10.78,16.03 90 top
R12  12.68,27.79 180 top
R13  12.68,22.64 180 top
R14  36.58,8.95 180 bottom
R15  43.31,9.12 180 bottom
R16  37.42,11.39 270 bottom
R17  44.23,11.39 270 bottom
R18  38.94,11.39 270 bottom
R19  45.7,11.39 270 bottom
S1  5.82,19.29 180 top
S2  5.82,29.32 0 top
S3  5.82,24.24 0 top
T1  20.96,28.4 90 bottom
T2  34.96,11.39 180 bottom
T3  41.59,11.39 180 bottom
U$1  33.53,3.89 0 bottom
VR1  7.25,34.93 90 top
X1  7.19,43.69 270 top
X2  20.78,17.58 90 bottom

### Tracks (layer width: path | path; a pad name or v marks a point on that pad's centre or on a via)
!CS
  Bottom 0.254: IC1.78 40.42,29.22 42.83,26.8 44.56,26.8 44.76,27.01 IC7.7
ADC  (via drill 0.3, 0.36)
  Top 0.152: 34.83,27.23 32.29,24.7 32.29,16.21 40.14,8.36 v40.14,8.06
  Top 0.254: 34.83,27.23 40.49,27.23 42.09,25.64 42.09,23.35 41.1,22.36 v41.1,21.95
  Top 0.406: IC2.P$47 46.59,18.2 45.27,19.51 v45.27,19.97
  Bottom 0.406: v45.27,19.97 45.27,20.28 43.59,21.95 v41.1,21.95 | v40.14,8.06 39.88,7.8 U$1.28
CTS  (via drill 0.36)
  Top 0.406: IC2.P$67 35.87,35.28 v35.74,35.16
  Bottom 0.254: IC1.68 34.52,31.95 34.52,33.94 v35.74,35.16
D+  (via drill 0.36)
  Top 0.305: X1.3 7.17,41.42
  Top 0.356: 7.17,41.42 v7.17,39.1
  Bottom 0.305: 37.6,39.42 IC3.15 37.61,44.09 36.86,44.84 24.87,44.84 19.87,39.83 7.7,39.83 7.17,39.3 v7.17,39.1
D-  (via drill 0.36)
  Top 0.305: 8.01,41.43 X1.2
  Top 0.356: X1.2 v7.98,39.1
  Bottom 0.305: IC3.16 36.96,43.4 36.18,44.18 25.18,44.18 20.1,39.1 v7.98,39.1
DBG-RXD  (via drill 0.36)
  Top 0.254: 16.91,16.24 IC2.P$16
  Top 0.406: 16.91,16.24 19.84,16.24 24.11,11.97 v24.11,7.65
  Bottom 0.203: 32.04,15.63 24.11,7.7
  Bottom 0.254: IC1.13 32.04,15.63
  Bottom 0.305: 24.11,7.7 v24.11,7.65
DBG-TXD  (via drill 0.36)
  Top 0.254: 16.91,17.15 IC2.P$15 | 25.02,9.12 v25.02,7.65 25.02,7.55
  Top 0.406: 16.91,17.15 20.07,17.15 25.02,12.2 25.02,9.12 v25.02,7.65
  Bottom 0.203: v25.02,7.65 25.02,7.86 25.05,7.86
  Bottom 0.254: IC1.12 32.54,15.34 25.05,7.86
DCD  (via drill 0.36)
  Top 0.254: IC2.P$70
  Top 0.406: IC2.P$70 32.87,35.29 v33,35.16
  Bottom 0.254: IC1.66 33.53,33.69 33,34.22 v33,35.16
DTR  (via drill 0.36)
  Top 0.406: IC2.P$72 30.87,35.82 v30.08,35.03
  Bottom 0.254: IC1.65 33.05,31.95 33.05,33.41 32.54,33.91 32.54,34.47 31.98,35.03 v30.08,35.03
FT_RX  (via drill 0.36)
  Top 0.305: v23.86,33.13 25.76,31.22 26.8,31.22 30.26,27.77 30.26,25.15 28.2,23.04 28.2,14.31 v30.26,12.2
  Top 0.406: v25.43,43.34 v25.43,45.57
  Bottom 0.254: IC3.5 31.76,45.73 31.6,45.57 v25.43,45.57
  Bottom 0.406: v23.86,33.13 23.86,41.76 v25.43,43.34 | v30.26,12.2 30.26,12.22 32.44,14.41 34.95,14.41 R4.1
FT_TX  (via drill 0.36)
  Top 0.305: v25.25,33.13 42.32,33.13 42.96,32.49 v42.96,14.87
  Top 0.406: v26.93,46.69 26.93,43.24 v26.47,42.78
  Bottom 0.254: v26.93,46.69 26.96,46.66 | v42.96,14.87 42.63,14.54 R3.1
  Bottom 0.406: 26.96,46.66 IC3.1 | v26.47,42.78 25.25,41.56 v25.25,33.13
GND  (via drill 0.3, 0.36)  (134 unrouted)
  other vias: 28.99,17.89 40.9,18.73 34.09,29.06 31.15,28.56 42.27,29.9 29.01,43.49 22.99,15.58 21.93,6.05 22.92,10.65 22.99,17.38 37.47,26.3 14.51,0.84 22.51,0.74 29.57,33.86 32.62,13.49 41.1,20.43 38.87,7.86 14.66,9.68 13.54,14.03 11.84,10.85 13.16,17.48 19.31,27.29 19.16,32.82 20.89,38.06 43.24,38.77 45.7,34.68 48.37,3.08 46.82,0.95 31.78,10.88 29.9,14.87 21.04,7.52 2.06,21.72 1.91,26.7 1.86,39.35 12.86,33.05 1.15,44.15 7.02,47.15 11.66,43.77 28.94,49.16 18.85,24.9 23.04,28.45 8.01,32.06 9.51,26.98 9.91,21.82 11.84,5.62 15.78,3.41 1.99,17.15 18.09,46.56 12.94,49.13 48.6,37.24 44.15,24.24 34.07,30.79 19.18,30.26 29.83,22.41 13.14,25.3 14.05,30.28
  pour Bottom: -0.4,50.4 50.4,50.4 50.4,-0.15 -0.4,-0.15
  pour Top: -0.4,50.4 50.4,50.4 50.4,-0.15 -0.4,-0.15
GPIO1  (via drill 0.3)
  Top 0.152: 32.9,6.16 IC2.P$31
  Top 0.203: IC2.P$31 32.85,6.18
  Top 0.406: v32.9,4.38 32.9,6.16
  Bottom 0.254: v32.9,4.38 32.95,4.43 38.23,4.43 38.61,4.81 U$1.27
INT1/DRDY
  Bottom 0.254: IC1.77 39.77,29.7 40.52,29.7 42.47,27.75 IC7.8
INT2
  Bottom 0.254: IC1.76 40.8,30.21 42.46,28.55 IC7.9
LED1  (via drill 0.36)
  Top 0.254: 27.01,34.07 v27.03,34.04
  Top 0.406: 27.01,34.07 17.48,34.07 14.79,31.38 14.79,24.98 14.03,24.21 LED5.A
  Bottom 0.254: v27.03,34.04 27.54,33.54 IC1.54
LED2  (via drill 0.36)
  Top 0.254: 26.93,35.26 v27.03,35.16
  Top 0.406: 26.93,35.26 17.13,35.26 13.3,31.44 LED4.A
  Bottom 0.254: v27.03,35.16 28.04,34.16 IC1.55
LED_RX  (via drill 0.36)
  Top 0.305: LED2.C 34.12,43.26 33.66,42.8 33.66,41.33 33.43,41.1 32.8,41.1 v32.42,40.72
  Bottom 0.305: v32.42,40.72 IC3.23
LED_TX  (via drill 0.36)
  Top 0.305: LED3.C 34.41,41.84 v34.98,41.84
  Bottom 0.305: IC3.22 33.05,40.32 34.58,41.84 v34.98,41.84
MIC1N  (via drill 0.36)
  Top 0.254: 20.05,4.4 v20.07,4.43
  Top 0.406: IC2.P$24 25.87,2.4 25.2,1.73 20.88,1.73 20.05,2.57 20.05,4.4
  Bottom 0.254: C21.2 17.28,4.46 | 18.8,5.66 C24.1 | 18.81,4.4 C22.2 | v20.07,4.43 20.05,4.4
  Bottom 0.305: 17.28,4.46 17.05,4.23
  Bottom 0.406: C21.2 C22.2 18.8,5.66 | C24.1 C23.1 | 20.05,4.4 18.81,4.4 | 17.05,4.23 MIC1.1 13.76,3.75 IC6.P$6
MIC1P  (via drill 0.36)
  Top 0.254: 21.37,4.4 v21.39,4.43
  Top 0.406: IC2.P$23 24.87,2.92 24.26,2.32 22.1,2.32 21.37,3.05 21.37,4.4
  Bottom 0.254: 18.8,1.34 C19.2
  Bottom 0.305: C21.1 17.28,2.56
  Bottom 0.406: C22.1 C21.1 | C19.2 C20.2 | C22.1 18.8,1.34 | C22.1 20.11,2.61 21.39,3.89 v21.39,4.43 | 17.28,2.56 14.47,2.56 MIC1.2 13.75,2.83 12.88,2.83 12.45,3.26 IC6.P$5
N$1  (via drill 0.36)
  Top 0.254: v38.66,40.16 C12.2
  Bottom 0.254: v38.66,40.16 38.66,38.56 38.28,38.18 36.48,38.18 36.3,38.36 | 36.3,38.36 IC3.17 | IC3.19 35.01,38.34 35.16,38.18 36.12,38.18 36.3,38.36
N$2
  Bottom 0.254: IC1.34 20.62,22.21 X2.2 20.45,22.43 20.45,24.09 20.47,24.1
  Bottom 0.406: C2.2 20.47,24.1
N$3
  Bottom 0.254: IC1.33 23.08,21.71 22.36,20.99 22.36,19.49 20.71,17.84 20.71,14.31 20.76,14.26 20.4,14.26 20.35,14.21 20.35,12.83 X2.1 | X2.1 20.43,12.31 | 24.43,11.72 C1.2 | 20.99,11.72 20.78,11.92 X2.1
  Bottom 0.406: 20.99,11.72 24.43,11.72
N$4
  Top 0.203: JP1.1 JP1.2
  Top 0.254: IC2.P$76
  Top 0.406: IC2.P$76 JP1.1 | JP1.2 27.7,38.71 27.84,38.56 27.84,37.22 IC2.P$75
N$6
  Bottom 0.305: T3.3 42.62,10.49 R17.2 R19.2
N$7
  Bottom 0.254: R7.2 R8.2
  Bottom 0.406: R7.2 21.03,29.76 21.39,29.39 T1.3
N$8  (via drill 0.36)
  Top 0.406: v8.24,10.9 R9.1
  Bottom 0.406: v8.24,10.9 8.28,10.76 IC5.2
N$9  (via drill 0.36)
  Top 0.406: R10.1 v10.78,10.9
  Bottom 0.406: v10.78,10.9 10.73,10.76 IC5.3
N$10  (via drill 0.36)
  Top 0.254: R11.2 10.8,16.96 v10.8,17.46
  Top 0.356: R11.2 C14.2
  Bottom 0.254: IC5.4 10.7,37.18 | v10.8,17.46 10.83,17.48
  Bottom 0.305: 10.7,37.18 10.65,37.13
  Bottom 0.406: v10.8,17.46 10.8,18.68 6.64,22.84 6.64,32.19 10.42,35.97 IC5.4
N$11  (via drill 0.3)
  Top 0.305: v48.77,11.08 49.13,10.72 LED7.C
  Bottom 0.254: 44.24,9.15 44.37,9.02
  Bottom 0.305: R15.2 44.24,9.15 | 44.37,9.02 44.47,9.12 47.81,9.12 48.77,10.09 v48.77,11.08
N$12
  Bottom 0.305: T3.1 41.64,12.45 41.64,9.61 42.12,9.12 R15.1
N$13
  Bottom 0.254: T2.3 36.06,10.49 R16.2 R18.2
N$14  (via drill 0.3)
  Top 0.152: 48.76,5.98 LED6.C
  Top 0.305: v48.42,5.98 48.76,5.98
  Bottom 0.254: 37.51,8.92 R14.2
  Bottom 0.305: 37.53,8.9 37.51,8.92
  Bottom 0.406: 37.53,8.9 40.57,8.9 41.92,7.55 45.19,7.55 46.77,5.98 v48.42,5.98
N$15
  Bottom 0.254: T2.1 34.98,9.58 35.62,8.95 R14.1
N$16  (via drill 0.71)
  Top 0.305: C18.1 17.6,40.1 17.41,40.29
  Top 1.016: v17.41,40.82 17.41,40.29 17.41,38.11 v17,37.7 | VR1.3 10.37,37.22 v13.16,37.22
  Bottom 1.016: v17.41,40.82 18.73,40.82 22.84,44.94 JP5.2 | v17,37.7 16.52,37.22 v13.16,37.22
N$17
  Top 1.016: JP4.1 15.53,42.3 15.53,36.12 14.33,34.93 VR1.2
N$18
  Top 0.406: R5.1 LED2.A
N$19
  Top 0.406: R6.1 31.84,41.87 LED3.A
N$20
  Top 0.305: LED5.C 11.8,22.66 R13.2
N$21
  Top 0.305: LED4.C 11.8,27.82 R12.2
N$22  (via drill 3.17)
  other vias: 8.87,2.65
N$23  (via drill 3.17)
  other vias: 46.97,40.75
N$38
  Top 0.356: LED1.A 2.52,15.83 1.33,14.64 R1.1
NETLIGHT  (via drill 0.36)
  Top 0.406: v44.2,13.19 44.48,13.34 44.48,21.42 45.26,22.2 IC2.P$51
  Bottom 0.305: R17.1 44.2,12.31 v44.2,13.19
PB1/SCK/D52  (via drill 0.36)
  Top 0.356: v15.73,7.32 15.35,7.7 5.95,7.7 ICSP.2
  Bottom 0.203: v15.73,7.32 16.95,7.32 18.04,8.41 18.17,8.54 24.36,8.54 28.56,12.73
  Bottom 0.254: IC1.20 28.56,12.73
PB2/MOSI/D51
  Bottom 0.254: IC1.21 28.05,16.48
  Bottom 0.305: 28.05,16.48 28.05,12.88 24.14,8.97 17.79,8.97 16.92,8.11 14.76,8.11
  Bottom 0.356: ICSP.5 5.95,7.7 14.36,7.7 14.76,8.11
PB3/MISO/D50
  Bottom 0.305: IC1.22 27.54,13.19 23.88,9.53 17.38,9.53 16.82,8.97 ICSP.1
  Bottom 0.356: IC1.22
PC0  (via drill 0.36)
  Top 0.254: 8.97,29.39 S2.P$2
  Top 0.406: v19.92,31.35 v24.21,31.35 | v10.34,30.61 9.61,30.61 9.23,30.23 S2.P$2
  Bottom 0.305: IC1.53 27.04,31.25 26.75,30.97 24.59,30.97 v24.21,31.35
  Bottom 0.406: v19.92,31.35 13.72,31.35 12.99,30.61 v10.34,30.61
PC3  (via drill 0.36)
  Top 0.254: 9.2,24.26 S3.P$2
  Top 0.406: v10.42,25.53 9.48,25.53 9.2,25.25 9.2,24.26 | v26.22,30.33 22.05,26.17 v19.92,26.17
  Bottom 0.305: IC1.56 28.53,30.84 28.02,30.33 v26.22,30.33
  Bottom 0.406: v19.92,26.17 11.05,26.17 v10.42,25.53
PD0/SCL  (via drill 0.36)
  Top 0.152: v25.66,26.12 25.66,8.18 v25.99,7.86
  Bottom 0.152: 25.99,5.87 U$1.17
  Bottom 0.254: IC1.43 24.32,26.7 25.53,26.7 25.66,26.57 v25.66,26.12
  Bottom 0.406: v25.99,7.86 25.99,5.87
PD1/SDA  (via drill 0.36)
  Top 0.152: v26.27,25.48 26.02,25.23 26.02,9.12 v27.29,7.86
  Bottom 0.152: 27.29,5.9 U$1.18
  Bottom 0.254: IC1.44 25.96,27.21 26.27,26.91 v26.27,25.48
  Bottom 0.406: v27.29,7.86 27.29,5.9
PD2/RX1  (via drill 0.36)
  Top 0.152: v26.96,26.12 26.96,25 26.37,24.42 26.37,9.99 v28.5,7.86
  Bottom 0.152: 28.5,5.85 U$1.19
  Bottom 0.254: IC1.45 24.33,27.69 26.22,27.69 26.96,26.96 v26.96,26.12
  Bottom 0.406: v28.5,7.86 28.5,5.85
PD3/TX1  (via drill 0.36)
  Top 0.152: v27.72,25.51 27.72,25.28 26.73,24.29 26.73,10.95 v29.83,7.86
  Bottom 0.152: 29.83,5.9 U$1.20
  Bottom 0.254: IC1.46 26.49,28.21 27.72,26.98 v27.72,25.51
  Bottom 0.406: v29.83,7.86 29.83,5.9
PD4  (via drill 0.36)
  Top 0.152: v28.33,26.12 28.33,25.15 27.08,23.91 27.08,11.87 v31.1,7.86
  Bottom 0.152: 31.1,5.9 U$1.21
  Bottom 0.254: IC1.47 26.77,28.71 28.33,27.16 v28.33,26.12 | v31.1,7.86 31.1,5.9
PD5  (via drill 0.36)
  Top 0.152: v28.96,25.51 28.96,25.15 27.44,23.63 27.44,12.78 v32.37,7.86
  Bottom 0.152: 32.37,5.9 U$1.22
  Bottom 0.254: IC1.48 26.88,29.21 28.96,27.13 v28.96,25.51
  Bottom 0.406: v32.37,7.86 32.37,5.9
PD6  (via drill 0.36)
  Top 0.152: v29.57,26.17 29.57,25.23 27.79,23.45 27.79,13.67 v33.61,7.86
  Bottom 0.152: 33.61,5.87 U$1.23
  Bottom 0.254: IC1.49 27.07,29.71 29.57,27.21 v29.57,26.17
  Bottom 0.406: v33.61,7.86 33.61,5.87
PE0/RX0/D0
  Bottom 0.305: IC1.2 37.54,15.84 38.22,15.16 R3.2
PE1/TX0/D1
  Bottom 0.254: IC1.3 37.04,14.62 R4.2
PF0/D54  (via drill 0.3, 0.36)
  Top 0.152: v38.64,19.44 38.61,19.41 38.61,16.69 43.11,12.2 45.24,12.2 47.71,9.73 47.71,3.64 44.66,0.59 41.18,0.59 v41.15,0.57
  Bottom 0.178: v41.15,0.57 U$1.2
  Bottom 0.254: IC1.97 38.91,19.71 v38.64,19.44
PF1/D55  (via drill 0.3, 0.36)
  Top 0.152: v37.93,20.2 37.93,16.87 42.96,11.84 45.09,11.84 47.4,9.53 47.4,3.82 44.71,1.1 40.44,1.1 39.94,0.59 v39.88,0.59
  Bottom 0.152: v39.88,0.59 U$1.3
  Bottom 0.254: IC1.96 37.94,20.21 v37.93,20.2
PF2/D56  (via drill 0.3, 0.36)
  Top 0.152: v37.24,19.49 37.24,17.07 42.83,11.49 44.96,11.49 47.1,9.35 47.1,3.97 44.53,1.4 39.27,1.4 38.64,0.77 v38.64,0.59
  Bottom 0.152: U$1.4 38.61,0.62 v38.64,0.59
  Bottom 0.254: IC1.95 38.33,20.71 38.16,20.88 37.7,20.88 37.19,20.38 37.19,19.54 v37.24,19.49
PF3/D57  (via drill 0.3, 0.36)
  Top 0.152: v36.48,20.35 36.66,20.17 36.66,17.15 42.68,11.13 44.86,11.13 46.79,9.2 46.79,4.1 44.41,1.71 38.54,1.71 37.42,0.59 v37.34,0.59
  Bottom 0.152: v37.34,0.59 U$1.5
  Bottom 0.254: IC1.94 38.47,21.21 38.39,21.29 38.39,21.32 38.31,21.39 37.52,21.39 v36.48,20.35
PF4/TCK  (via drill 0.3, 0.36)
  Top 0.152: v36.02,19.49 36.02,17.28 42.53,10.78 44.71,10.78 46.49,9 46.49,4.25 44.25,2.01 38.39,2.01 37.78,1.38 36.79,1.38 36.07,0.67 v36.07,0.59
  Bottom 0.178: v36.07,0.59 U$1.6
  Bottom 0.203: v36.02,19.49 36.02,19.72 35.8,19.95 35.8,20.68 36.07,20.96 36.41,20.96 37.24,21.8 38.49,21.8 38.61,21.67 39.72,21.67 IC1.93
PF5/TMS  (via drill 0.3, 0.36)
  Top 0.152: v36.25,21.85 35.44,21.04 35.44,17.43 42.4,10.47 44.58,10.47 46.13,8.92 46.13,4.35 44.1,2.32 38.26,2.32 37.65,1.71 36.51,1.71 35.92,1.12 35.31,1.12 v34.8,0.59
  Bottom 0.178: v34.8,0.59 U$1.7
  Bottom 0.203: IC1.92 37.09,22.21 36.73,21.85 v36.25,21.85
PF6/TDO  (via drill 0.3, 0.36)
  Top 0.152: v35.34,22.38 35.13,22.18 35.13,17.3 42.27,10.17 44.46,10.17 45.83,8.8 45.83,4.5 44,2.67 38.18,2.67 37.47,2.01 36.38,2.01 35.8,1.43 34.83,1.43 33.99,0.59 v33.53,0.59
  Bottom 0.178: v33.53,0.59 U$1.8
  Bottom 0.203: IC1.91 39.69,22.64 35.82,22.64 35.57,22.38 v35.34,22.38
PF7/TDI  (via drill 0.3, 0.36)
  Top 0.152: v36.2,23.22 35.97,22.99 35.11,22.99 34.73,22.61 34.73,17.23 42.09,9.86 44.23,9.86 45.52,8.57 45.52,4.66 43.87,3 37.98,3 37.27,2.32 36.25,2.32 35.67,1.73 34.65,1.73 34.04,1.12 33.31,1.12 32.77,0.59 v32.26,0.59
  Bottom 0.178: v32.26,0.59 U$1.9
  Bottom 0.203: IC1.90 39.74,23.2 39.72,23.22 v36.2,23.22
PK0  (via drill 0.3)
  Top 0.152: v35.34,23.83 34.42,22.92 34.42,17.1 41.97,9.56 44.02,9.56 45.19,8.39 45.19,4.76 43.75,3.31 37.8,3.31 37.12,2.62 36.12,2.62 35.54,2.04 34.5,2.04 33.89,1.43 33.18,1.43 32.87,1.12 31.96,1.12 31.43,0.59 v30.99,0.59
  Bottom 0.178: IC1.89 36.52,23.71 36.41,23.83 v35.34,23.83 35.31,23.86 | v30.99,0.59 U$1.10
PK1  (via drill 0.3)
  Top 0.152: v36.23,24.42 36.2,24.44 35.01,24.44 34.07,23.5 34.07,16.95 41.79,9.23 43.92,9.23 44.84,8.31 44.84,4.86 43.64,3.66 37.67,3.66 36.96,2.95 35.97,2.95 35.39,2.37 34.37,2.37 33.76,1.76 33.05,1.76 32.75,1.45 31.81,1.45 31.5,1.15 30.66,1.15 30.11,0.59 v29.72,0.59
  Bottom 0.178: IC1.88 39.73,24.19 36.76,24.19 36.53,24.42 v36.23,24.42 | v29.72,0.59 U$1.11
PK2  (via drill 0.3)
  Top 0.152: 35.06,25.05 35.03,25.05 | 35.06,25.05 v35.36,25.05 | 35.06,25.05 35.06,25 33.76,23.7 33.76,16.77 41.61,8.92 43.52,8.92 44.51,7.93 44.51,5.01 43.49,3.99 37.55,3.99 36.84,3.28 35.85,3.28 35.26,2.7 34.25,2.7 33.64,2.09 32.92,2.09 32.62,1.78 31.66,1.78 31.35,1.48 30.51,1.48 30.18,1.15 29.45,1.15 28.89,0.59 v28.45,0.59
  Bottom 0.178: IC1.87 39.74,24.7 36.96,24.7 36.61,25.05 v35.36,25.05 | v28.45,0.59 U$1.12
PK3  (via drill 0.3)
  Top 0.152: v36.25,25.66 35.19,25.66 33.33,23.81 33.33,16.72 41.43,8.62 43.31,8.62 44.15,7.78 44.15,5.24 43.24,4.32 37.39,4.32 36.68,3.61 35.72,3.61 35.13,3.03 34.12,3.03 33.51,2.42 32.8,2.42 32.49,2.11 31.53,2.11 31.22,1.81 30.38,1.81 30.05,1.48 29.32,1.48 28.99,1.15 28.15,1.15 27.62,0.62 v27.18,0.62
  Bottom 0.152: v27.18,0.62 U$1.13
  Bottom 0.178: IC1.86 37.22,25.2 36.76,25.66 v36.25,25.66
PK4  (via drill 0.3)
  Top 0.152: v35.36,26.3 34.88,26.3 32.92,24.34 32.92,16.62 41.33,8.24 43.06,8.24 43.8,7.5 43.8,5.42 43.06,4.7 37.29,4.7 36.53,3.94 35.59,3.94 35.01,3.36 33.99,3.36 33.38,2.75 32.67,2.75 32.37,2.45 31.4,2.45 31.1,2.14 30.26,2.14 29.93,1.81 29.19,1.81 28.86,1.48 28.02,1.48 27.72,1.18 26.88,1.18 26.32,0.62 v25.91,0.62
  Bottom 0.152: IC1.85 37.24,25.71 36.66,26.3 v35.36,26.3 | v25.91,0.62 U$1.14
PK5  (via drill 0.3, 0.36)
  Top 0.152: v36.25,27.92 35.01,27.92 31.96,24.87 31.96,13.29 v37.34,7.86
  Bottom 0.152: v36.25,27.92 36.94,27.92 38.64,26.22 IC1.84
  Bottom 0.406: v37.34,7.86 U$1.26
PK6  (via drill 0.3, 0.36)
  Top 0.152: v36.07,7.86 36.07,8.64 31.63,13.09 31.63,25.18 34.93,28.48 v35.36,28.48
  Bottom 0.152: IC1.83 38.6,26.71 36.84,28.48 v35.36,28.48
  Bottom 0.406: v36.07,7.86 U$1.25
PK7  (via drill 0.3, 0.36)
  Top 0.152: v36.3,29.01 36.28,29.04 35.01,29.04 31.25,25.28 31.25,12.86 34.8,9.3 v34.8,7.86
  Bottom 0.152: IC1.82 39.73,27.18 38.79,27.18 36.96,29.01 v36.3,29.01
  Bottom 0.406: v34.8,7.86 U$1.24
POWERKEY
  Bottom 0.254: IC1.50 23.35,30.21 R7.1
PWM1  (via drill 0.3)
  Top 0.152: v41.03,25.58 39.73,26.88 35.03,26.88 32.62,24.47 32.62,16.36 41.18,7.96 41.2,7.93 42.91,7.93 43.49,7.35 43.49,5.59 42.91,5.01 37.14,5.01 36.41,4.27 35.47,4.27 34.88,3.69 33.87,3.69 33.26,3.08 32.54,3.08 32.24,2.77 31.27,2.77 30.97,2.47 30.11,2.47 29.77,2.14 29.06,2.14 28.73,1.81 27.9,1.81 27.59,1.5 26.75,1.5 26.42,1.18 25.58,1.18 25.05,0.64 v24.64,0.64
  Top 0.406: IC2.P$48 46.7,19.2 46.34,19.56 v46.34,20.2
  Bottom 0.152: v24.64,0.64 U$1.15
  Bottom 0.406: v46.34,20.2 46.34,20.5 44.15,22.69 41.97,22.69 41,23.65 41,25.56 v41.03,25.58
PWRKEY  (via drill 0.36)
  Top 0.254: IC2.P$3 16.88,29.22 | v19.92,29.19 v19.91,29.2
  Top 0.406: v19.91,29.2 IC2.P$3
  Bottom 0.254: T1.1 19.92,28.45
  Bottom 0.406: 19.92,28.45 v19.92,29.19
RESET  (via drill 0.36)
  Top 0.254: v4.63,15.2 4.62,15.21 | v13.52,9.84 R2.1 | v22.21,18.42 21.5,19.13 v18.78,19.13
  Top 0.305: LED1.C 4.63,15.84
  Top 0.406: 4.62,15.21 LED1.C | 4.63,15.84 4.63,18.65 3.99,19.29 S1.P$2
  Bottom 0.254: v4.63,15.2 4.55,15.12 | IC1.30 23.49,20.21 23.48,20.2 23.37,20.2 23.04,19.87 23.04,19.26 v22.21,18.42 | 13.54,9.81 v13.52,9.84 13.67,9.84
  Bottom 0.406: v18.78,19.13 14.66,15.02 14.66,10.83 13.67,9.84 | 3.33,10.17 6.08,10.17 12.4,10.17 13.19,10.17 v13.52,9.84 | 3.33,10.17 ICSP.3 | 3.33,10.17 3.33,13.9 v4.63,15.2
RI  (via drill 0.36)
  Top 0.406: IC2.P$69 33.87,35.29 v33.99,35.16
  Bottom 0.254: IC1.67 34.04,35.06 v33.99,35.16
RTS  (via drill 0.36)
  Top 0.406: IC2.P$66 36.87,34.53 36.18,33.84 v35.74,33.84
  Bottom 0.254: v35.74,33.84 35.57,33.84 35.03,33.31 IC1.69
RXD  (via drill 0.36)
  Top 0.254: IC2.P$68 34.83,37.16
  Top 0.406: v31.93,34.14 32.09,34.3 34.47,34.3 34.87,34.69 IC2.P$68
  Bottom 0.254: IC1.64 32.54,33.2 31.93,33.81 v31.93,34.14
SCL
  Bottom 0.254: IC7.14 44.76,32.39 44.58,32.57 41.03,32.57 40.09,31.63 38.46,31.63 38.15,31.94 IC1.75
SDA/SDI/SDO
  Bottom 0.254: IC1.74 37.52,31.92 37.52,31.27 37.67,31.12 41.89,31.12 42.52,31.75 IC7.13
SDO
  Bottom 0.254: IC7.12 42.56,30.95 42.3,30.69 37.47,30.69 37.04,31.12 IC1.73
SIM-CLK
  Top 0.254: IC2.P$19 16.07,13.17 16.07,13.1
  Top 0.305: IC2.P$19 16.85,13.21 | R10.2 10.8,13.25 10.8,13.85 10.93,13.98 12.66,13.98 13.04,13.6 13.04,12.28 13.38,11.93 IC4.P$4
  Top 0.406: 14.81,11.92 14.81,11.93 | 14.81,11.92 14.89,11.92 16.07,13.1 | 14.81,11.92 IC4.P$4
SIM-DATA
  Top 0.305: IC2.P$17 | 11.14,15.2 R11.1
  Top 0.406: IC2.P$17 15.86,15.2 | 15.86,15.2 14.27,13.61 IC4.P$6 | 15.86,15.2 11.14,15.2
SIM-RST  (via drill 0.36)
  Top 0.305: IC4.P$5 v13.8,12.58 | v9.23,13.42 8.43,13.42 R9.2
  Top 0.406: IC2.P$18 15.72,14.2 15.37,13.85 15.37,13.32 14.64,12.58 IC4.P$5
  Bottom 0.305: v13.8,12.58 12.53,12.58 11.13,13.98 9.79,13.98 v9.23,13.42
SIM-VDD  (via drill 0.36)
  Top 0.203: 12.36,11.92 11.99,11.92 11.82,12.15 6.03,12.15 5.7,11.82
  Top 0.254: IC4.P$3 12.36,11.92 | 5.7,11.82 C13.1
  Top 0.406: C13.1 v5.67,10.9 | 16.84,12.17 IC2.P$20 16.85,12.18 16.85,11.61 16.29,11.05 12.61,11.05 12.38,11.28 IC4.P$3
  Bottom 0.406: v5.67,10.9 5.68,10.79 IC5.1
SPK1N  (via drill 0.3)
  Top 0.152: 22.84,6.17 IC2.P$21
  Top 0.406: 22.84,6.17 22.84,4.91 22.16,4.22 v22.16,3.54
  Bottom 0.254: U$1.30 42.42,4.15 41.64,3.36 22.33,3.36 arc-90 v22.16,3.54
SPK1P  (via drill 0.3)
  Top 0.152: 23.83,6.16 IC2.P$22
  Top 0.406: 23.83,6.16 23.83,4.88 23.09,4.15 v23.09,3.94
  Bottom 0.254: v23.09,3.94 32.24,3.94 32.44,3.77 33.28,3.77 33.46,3.92 40.52,3.92 41.15,4.55 U$1.29
STATUS  (via drill 0.36)
  Top 0.406: v43.19,13.49 43.8,14.46 43.8,21.6 45.4,23.2 IC2.P$52
  Bottom 0.254: R16.1 37.39,12.31 37.39,13.11 37.78,13.49 v43.19,13.49
TEMP-BATT
  Top 0.406: IC2.P$73 29.87,38.76 30.56,39.45 35.59,39.45 37.27,41.13 37.27,43.82 38.61,45.17 JP2.2
TXD  (via drill 0.36)
  Top 0.254: 31.83,37.16 IC2.P$71
  Top 0.406: 31.83,37.16 31.83,35.62 30.94,34.73 v30.94,34.17
  Bottom 0.254: IC1.63 32.04,33.05 30.94,34.14 v30.94,34.17
USB_5V  (via drill 0.36)
  Top 0.254: IC2.P$74
  Top 0.406: 29.84,41.64 30.02,41.82 R6.2 | IC2.P$74 v28.86,35.03
  Top 0.61: IC2.P$74 28.87,38.58 28.86,38.59 28.86,41.51 28.86,41.64
  Top 1.016: C10.2 30.02,44.52 R5.2 R6.2 30.02,41.51 28.86,41.51 20.15,41.51 16.36,45.3 JP4.2
  Bottom 0.254: IC3.20 34.36,38.14 31.88,35.67 29.55,35.67 28.91,35.03 v28.86,35.03
  Bottom 1.016: C11.A 12.07,45.3 15.98,45.3 JP4.2
USB_PWR
  Top 0.254: 9.2,41.92 9.2,41.85 X1.1
  Top 1.016: 9.2,41.92 9.38,41.74 9.38,39.88 9.86,39.4 12.61,39.4 13.75,40.19 13.75,47 14.61,47.86 JP4.3
VBAT  (via drill 0.3, 0.36)
  Top 0.152: 48.36,8.81 48.06,9.1 48.06,9.84 45.37,12.53 43.26,12.53 41.99,13.8 v41.99,15.3
  Top 0.178: 48.36,8.81 LED7.A
  Top 0.254: C8.2 R1.2 | IC2.P$63 40.37,37.2 IC2.P$62 | v39.91,32.47 33.53,32.47 v31.13,30.08 | v21.67,17.23 20.91,17.99 v19.01,17.99 | 13.53,6.79 R2.2
  Top 0.305: 39.91,37.15 IC2.P$63 | C9.2 R2.2 13.74,6.59 | 3.43,11.35 C8.2 | LED7.A 49.08,8.76 v49.08,8.16 49.13,8.11 LED6.A
  Top 0.406: v39.91,34.32 39.91,37.15 | v18.52,10.24 18.52,7.5 17.2,6.18 14.99,6.18 14.38,6.79 13.53,6.79 | 3.43,11.35 3.43,5.98 4.3,5.11 5.9,5.11 ICSP.6 7.59,6.8 C9.2
  Top 0.61: JP3.2 arc90 45.54,44.95
  Top 1.778: 40.49,39.22 40.37,39.1 40.37,37.2
  Top 2.032: 40.49,39.22 40.49,40.37 45.27,45.14 JP3.2
  Bottom 0.178: 42.45,1.96 U$1.1
  Bottom 0.254: IC1.10 | 34.19,18.21 34.25,18.21 | 34.25,18.21 34.37,18.21 | IC1.31 | 31.05,31.93 IC1.61 | 31.05,30.16 v31.13,30.08 32.01,30.08 34.47,27.62 34.47,27.64 33.91,28.2 | v41.99,15.3 41.52,15.3 39.71,17.11 C7.1 39.77,18.2 IC1.100 40.5,18.21 40.6,18.12 41.89,18.12 42.45,18.68 42.45,19.17 C3.2 42.31,19.41 40.67,19.41 40.47,19.21 IC1.98 | v39.91,34.32 39.92,34.34 | 45.69,27.68 IC7.6 45.7,27.69 45.7,26.47 45.55,26.32 42.63,26.32 | 42.93,25.75 C25.2 42.53,26.22 42.63,26.32 | 24.45,16.54 C5.2 | 24.45,16.54 22.36,16.54 v21.67,17.23 | 24.47,16.56 24.45,16.54 | 34.25,18.21 34.47,18.44 | IC1.80 39.77,28.2 40.75,28.2 42.63,26.32 | C26.1 arc-90 33.53,15.36
  Bottom 0.305: 34.19,18.21 33.53,17.56 IC1.10 33.53,15.36 | IC1.100 34.37,18.21 34.37,19.79 33.46,20.71 26.85,20.71 | 26.85,20.71 IC1.31 | 31.05,30.16 31.05,31.93 | 38.79,33.65 C6.2 | IC7.1 45.73,31.79 45.73,32.57 45.04,33.26 40.77,33.26 39.99,32.47 v39.91,32.47 | 31.12,46.67 IC3.4 | C17.A 41.82,41.45 | 24.47,16.56 24.47,17.05 25,17.58 26.09,17.58 26.85,18.34 26.85,20.71 | 34.47,18.44 34.47,27.62 | IC1.80 39.05,28.2 37.17,30.08 32.01,30.08 | 42.53,1.89 42.45,1.96
  Bottom 0.406: v39.91,34.32 v39.91,32.47 39.2,32.47 38.79,32.87 38.79,33.65 | 31.12,46.67 31.12,48.01 31.38,48.27 38.21,48.27 39.1,47.38 39.1,44.18 41.82,41.45 | v19.01,17.99 18.52,17.51 v18.52,10.24 | 42.53,1.89 48.29,1.89 arc90 49.51,3.11 49.51,7.73 arc90 v49.08,8.16
  Bottom 0.61: C4.2 47.82,45.19 JP3.2
  Bottom 2.032: C17.A 45.52,44.94 JP3.2
VRTC  (via drill 0.36)
  Top 0.61: IC2.P$42 46.05,13.2 45.6,13.65 v45.6,15.2
  Bottom 0.61: C16.1 45.58,15.17 v45.6,15.2 45.6,17.44 C15.A

### Text on the board
Top: mmca
tPlace: NSL | Tracker | USB | v1.1 | EXT | CHRG | RX | BATT | BATT | EXT | TEMP | + | TX | GPS | ANT PWR | RST | NET | PWR | nullspacelabs.com
bPlace: charliex/mmca | Place either C15 or C16